# EasyEDA Pro project DartGuidence_Controller.epro

# Schematic Schematic1
Board Name: Board1; Create Date: 2024-11-17; Page Name: P1; Project Name: DartGuidence_Controller; Schematic Name: Schematic1; Update Date: 2024-12-12; Company: 嘉立创EDA; Page Size: A3; Version: V1.0
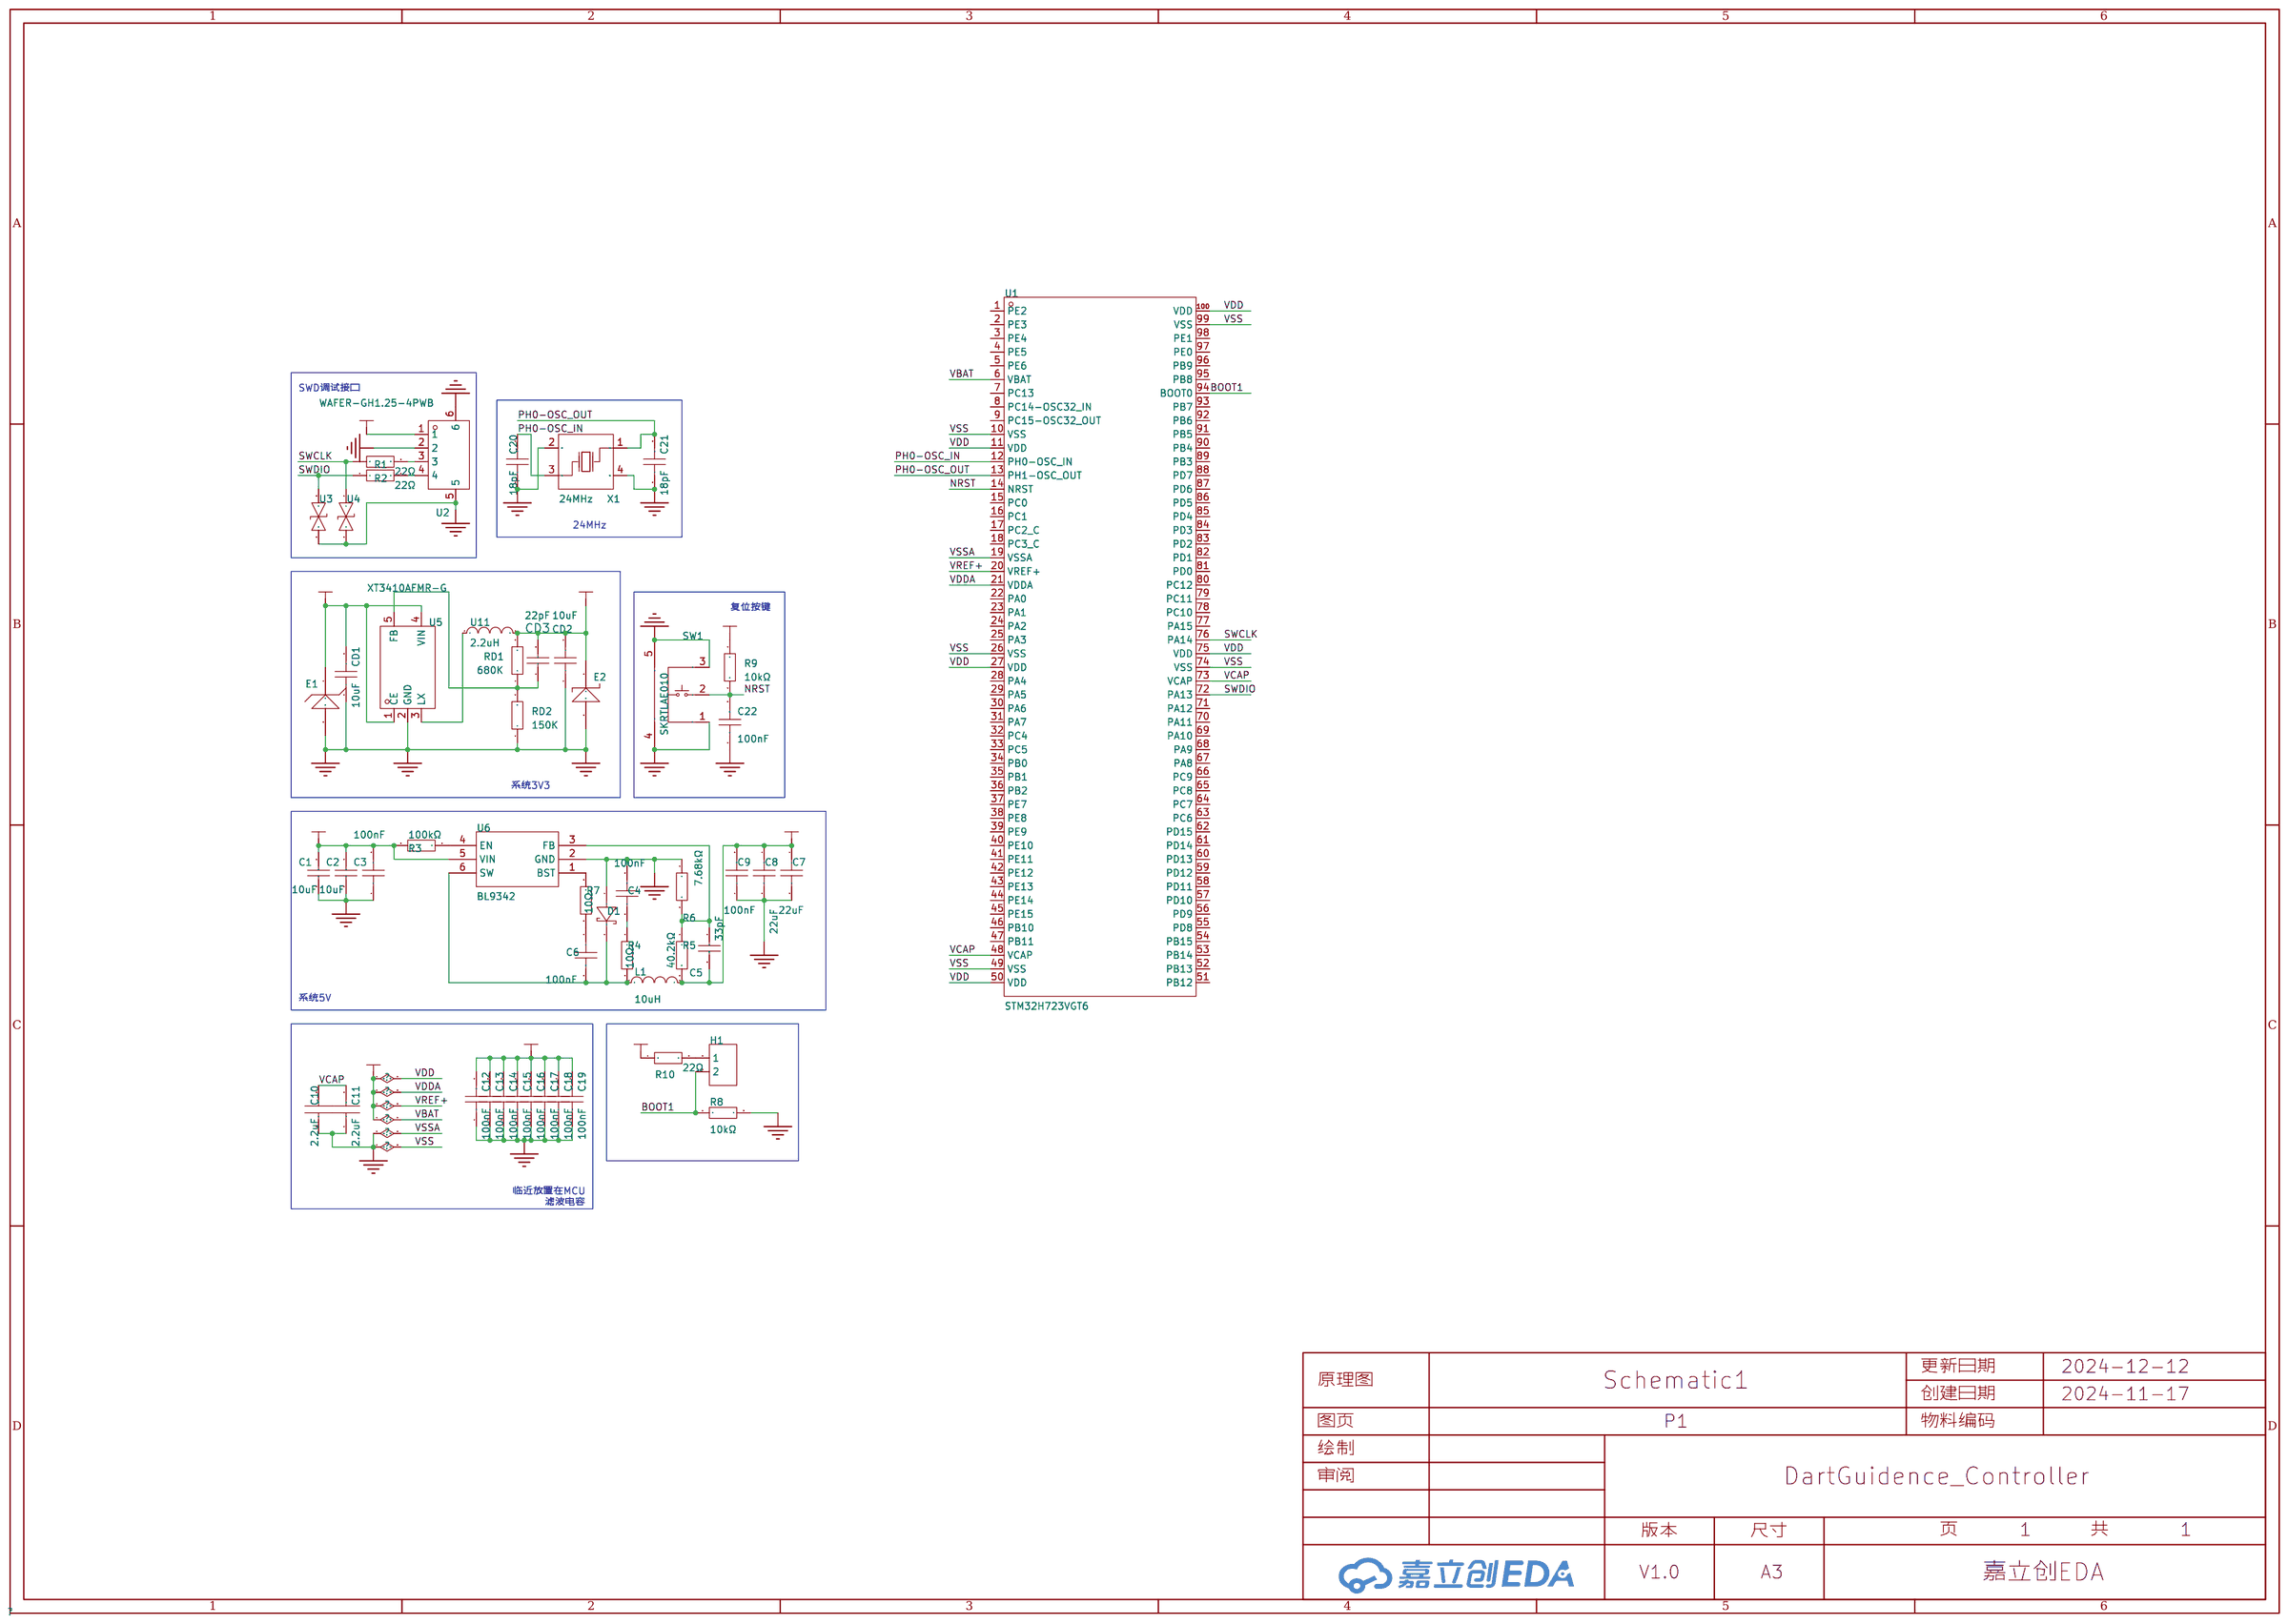
[diagram p0: schematic sheet]

## Parts
C1  10uF  [C1206]
C2  10uF  [C1206]
C3  100nF  [C0402]
C4  100nF  [C0402]
C5  33pF  [C0402]
C6  100nF  [C0402]
C7  22uF  [C0603]
C8  22uF  [C0603]
C9  100nF  [C0402]
C10  2.2uF  [C0402]
C11  2.2uF  [C0402]
C12  100nF  [C0402]
C13  100nF  [C0402]
C14  100nF  [C0402]
C15  100nF  [C0402]
C16  100nF  [C0402]
C17  100nF  [C0402]
C18  100nF  [C0402]
C19  100nF  [C0402]
C20  18pF  [C0402]
C21  18pF  [C0402]
C22  100nF  [C0402]
CD1  10uF  [C0402]
CD2  10uF  [C0402]
CD3  22pF  [C0402]
D1  SD103AWS  [SOD-323_L1.7-W1.3-LS2.5-FD]
E1  CESD5V0D3 ZA  [SOD-323_L1.8-W1.3-LS2.5-RD]
E2  CESD3V3D3 YU  [SOD-323_L1.8-W1.3-LS2.5-RD]
H1  -  [HDR-TH_2P-P2.54-V-F]
L1  10uH  [IND-SMD_L4.0-W4.0]
R1  22Ω  [R0402]
R2  22Ω  [R0402]
R3  100kΩ  [R0402]
R4  10Ω  [R0402]
R5  40.2kΩ  [R0402]
R6  7.68kΩ  [R0402]
R7  10Ω  [R0402]
R8  10kΩ  [R0402]
R9  10kΩ  [R0402]
R10  22Ω  [R0402]
RD1  680K  [R0402]
RD2  150K  [R0402]
SW1  SKRTLAE010  [KEY-SMD_SKRTLAE010]
U1  STM32H723VGT6  [LQFP-100_L14.0-W14.0-P0.50-LS16.0-BL]
U2  WAFER-GH1.25-4PWB  [CONN-SMD_4P-P1.25_XUNPU_WAFER-GH1.25-4PWB]
U3  ESD9B5.0ST5G  [SOD-923_L0.8-W0.6-LS1.0-BI]
U4  ESD9B5.0ST5G  [SOD-923_L0.8-W0.6-LS1.0-BI]
U5  XT3410AFMR-G  [SOT-23-5_L3.0-W1.7-P0.95-LS2.8-BL]
U6  BL9342  [SOT-23-6_L2.9-W1.6-P0.95-LS2.8-BL]
U11  2.2uH  [IND-SMD_L2.5-W2.0]
X1  24MHz  [CRYSTAL-SMD_4P-L2.5-W2.0-BL]

## Library data of the parts
C1 C2 = CL31A106KBHNNNE: 容值:10uF;精度:±10%;额定电压:50V;材质(温度系数):X5R;; LCSC Part Name: 10uF ±10% 50V; Supplier Part: C13585; Manufacturer: SAMSUNG(三星); Supplier Footprint: 1206; JLCPCB Part Class: 基础库; Datasheet: https://atta.szlcsc.com/upload/public/pdf/source/20160218/1457707763339.pdf; Supplier: LCSC; Tolerance: ±10%; Voltage Rated: 50V; Temperature Coefficient: X5R
C3 C4 C6 C9 = CL05B104KB54PNC: 容值:100nF;精度:±10%;额定电压:50V;材质(温度系数):X7R;; LCSC Part Name: 100nF ±10% 50V; Supplier Part: C307331; Manufacturer: SAMSUNG(三星); Supplier Footprint: 0402; JLCPCB Part Class: 基础库; Datasheet: https://atta.szlcsc.com/upload/public/pdf/source/20160218/1457707763339.pdf; Supplier: LCSC; Tolerance: ±10%; Voltage Rated: 50V; Temperature Coefficient: X7R
C5 = 0402CG330J500NT: 容值:33pF;精度:±5%;额定电压:50V;材质(温度系数):C0G;; LCSC Part Name: 33pF ±5% 50V; Supplier Part: C1562; Manufacturer: FH(风华); Supplier Footprint: 0402; JLCPCB Part Class: 基础库; Datasheet: https://atta.szlcsc.com/upload/public/pdf/source/20200305/C486355_26A10D38EF8C2A5C37091D0039909270.pdf; Supplier: LCSC; Tolerance: ±5%; Voltage Rated: 50V; Temperature Coefficient: C0G
C7 C8 = CL10A226MP8NUNE: 容值:22uF;精度:±20%;额定电压:10V;材质(温度系数):X5R;; LCSC Part Name: 22uF ±20% 10V; Supplier Part: C86295; Manufacturer: SAMSUNG(三星); Supplier Footprint: 0603; JLCPCB Part Class: 扩展库; Datasheet: https://atta.szlcsc.com/upload/public/pdf/source/20160218/1457707763339.pdf; Supplier: LCSC; Tolerance: ±20%; Voltage Rated: 10V; Temperature Coefficient: X5R
C10 C11 = CL05A225MQ5NSNC: 容值:2.2uF;精度:±20%;额定电压:6.3V;材质(温度系数):X5R;; LCSC Part Name: 2.2uF ±20% 6.3V; Supplier Part: C12530; Manufacturer: SAMSUNG(三星); Supplier Footprint: 0402; JLCPCB Part Class: 基础库; Datasheet: https://atta.szlcsc.com/upload/public/pdf/source/20160218/1457707763339.pdf; Supplier: LCSC; Tolerance: ±20%; Voltage Rated: 6.3V; Temperature Coefficient: X5R
C12-C19 C22 = CC0402KRX7R6BB104: 容值:100nF;精度:±10%;额定电压:10V;材质(温度系数):X7R;; LCSC Part Name: 100nF ±10% 10V; Supplier Part: C309458; Manufacturer: YAGEO(国巨); Supplier Footprint: 0402; JLCPCB Part Class: 扩展库; Datasheet: https://atta.szlcsc.com/upload/public/pdf/source/20181008/C309510_22F155564471FAF6A489F7D68F34234E.pdf; Supplier: LCSC; Tolerance: ±10%; Voltage Rated: 10V; Temperature Coefficient: X7R
C20 C21 = CC0402FRNPO9BN180: 容值:18pF;精度:±1%;额定电压:50V;材质(温度系数):NP0;; LCSC Part Name: 18pF ±1% 50V; Supplier Part: C541431; Manufacturer: YAGEO(国巨); Supplier Footprint: 0402; JLCPCB Part Class: 扩展库; Datasheet: https://atta.szlcsc.com/upload/public/pdf/source/20200615/C541431_FAFCAA54FB89671184DDCAE44D787100.pdf; Supplier: LCSC; Tolerance: ±1%; Voltage Rated: 50V; Temperature Coefficient: NP0
CD1 CD2 = CL05A106MP5NUNC: 容值:10uF;精度:±20%;额定电压:10V;材质(温度系数):X5R;; LCSC Part Name: 10uF ±20% 10V; Supplier Part: C315248; Manufacturer: SAMSUNG(三星); Supplier Footprint: 0402; JLCPCB Part Class: Extended Part; Datasheet: https://atta.szlcsc.com/upload/public/pdf/source/20200102/C478861_C4302703595930F3C0E62DAD3349F1AA.pdf; Supplier: LCSC; Tolerance: ±20%; Voltage Rated: 10V; Temperature Coefficient: X5R
CD3 = 0402CG220J500NT: 容值:22pF;精度:±5%;额定电压:50V;材质(温度系数):C0G;; LCSC Part Name: 22pF ±5% 50V; Supplier Part: C1555; Manufacturer: FH(风华); Supplier Footprint: 0402; JLCPCB Part Class: 基础库; Datasheet: https://atta.szlcsc.com/upload/public/pdf/source/20200305/C486355_26A10D38EF8C2A5C37091D0039909270.pdf; Supplier: LCSC; Tolerance: ±5%; Voltage Rated: 50V; Temperature Coefficient: C0G
D1 = SD103AWS_C7420360: 二极管配置:独立式;正向压降(Vf):370mV@20mA;直流反向耐压(Vr):40V;平均整流电流(Io):350mA;; LCSC Part Name: 电压:40V 电流:350mA; Supplier Part: C7420360; Manufacturer: 宏迦橙; Supplier Footprint: SOD-323; JLCPCB Part Class: 扩展库; Datasheet: https://atta.szlcsc.com/upload/public/pdf/source/20230828/EB98D42952FEC013AACB2F62A2475546.pdf; Supplier: LCSC; Diode Configuration: 独立式; Forward Voltage (Vf@If): 370mV@20mA; Reverse Voltage (Vr): 40V; Average Rectified Current (Io): 350mA; Reverse Leakage Current (Ir): 5uA@40V; Peak forward surge current: 1.5A
E1 = CESD5V0D3 ZA: 极性:单向;反向截止电压(Vrwm):5V;击穿电压(VBR):6.2V;钳位电压(Vc)@Ipp:15.5V;; LCSC Part Name: 单向ESD; Supplier Part: C22643; Manufacturer: CJ(江苏长电/长晶); Supplier Footprint: SOD-323; JLCPCB Part Class: 扩展库; Datasheet: https://atta.szlcsc.com/upload/public/pdf/source/20140301/1457707004115.pdf; Supplier: LCSC; Polarity: 单向; Reverse Stand-Off Voltage (Vrwm): 5V; Breakdown Voltage (VBR): 6.2V; Peak Pulse Current(Ipp)@8/20us: 15A; Clamping Voltage@Ipp: 15.5V
E2 = CESD3V3D3 YU: 极性:单向;反向截止电压(Vrwm):3.3V;击穿电压(VBR):5V;钳位电压(Vc)@Ipp:13V;; LCSC Part Name: 单向ESD; Supplier Part: C38388; Manufacturer: CJ(江苏长电/长晶); Supplier Footprint: SOD-323; JLCPCB Part Class: 扩展库; Datasheet: https://atta.szlcsc.com/upload/public/pdf/source/20150915/1457707371129.pdf; Supplier: LCSC; Polarity: 单向; Reverse Stand-Off Voltage (Vrwm): 3.3V; Breakdown Voltage (VBR): 5V; Peak Pulse Current(Ipp)@8/20us: 16A; Clamping Voltage@Ipp: 13V
H1 = HDR-F_2.54_1x2P: Supplier Part: C49661; Supplier Footprint: 插件
L1 = FHD4020S-100MT: 电感值:10uH;精度:±20%;额定电流:2.35A;饱和电流(Isat):3.5A;; LCSC Part Name: 10uH ±20% 3.5A; Supplier Part: C602032; Manufacturer: cjiang(长江微电); Supplier Footprint: SMD,4x4mm; JLCPCB Part Class: 扩展库; Datasheet: https://atta.szlcsc.com/upload/public/pdf/source/20200609/C601990_BCEA243EC4DA0A9A288AA78A6DFB48A5.pdf; Supplier: LCSC; Tolerance: ±20%; Rated Current: 2.35A; Saturation Current (Isat): 3.5A; DC Resistance (DCR): 190mΩ
R1 R2 R10 = 0402WGF220JTCE: 电阻类型:厚膜电阻;阻值:22Ω;精度:±1%;功率:62.5mW;最大工作电压:50V;温度系数:±100ppm/℃;; LCSC Part Name: 22Ω ±1% 62.5mW 厚膜电阻; Supplier Part: C25092; Manufacturer: UNI-ROYAL(厚声); Supplier Footprint: 0402; JLCPCB Part Class: 基础库; Datasheet: https://atta.szlcsc.com/upload/public/pdf/source/20200306/C422600_1E6D84923E4A46A82E41ADD87F860B5C.pdf; Supplier: LCSC; Type: 厚膜电阻; Tolerance: ±1%; Power(Watts): 62.5mW; Overload Voltage (Max): 50V; Temperature Coefficient: ±100ppm/℃; Operating Temperature Range: -55℃~+155℃
R3 = 0402WGF1003TCE: 电阻类型:厚膜电阻;阻值:100kΩ;精度:±1%;功率:62.5mW;最大工作电压:50V;温度系数:±100ppm/℃;; LCSC Part Name: 100kΩ ±1% 62.5mW 厚膜电阻; Supplier Part: C25741; Manufacturer: UNI-ROYAL(厚声); Supplier Footprint: 0402; JLCPCB Part Class: 基础库; Datasheet: https://atta.szlcsc.com/upload/public/pdf/source/20200306/C422600_1E6D84923E4A46A82E41ADD87F860B5C.pdf; Supplier: LCSC; Type: 厚膜电阻; Tolerance: ±1%; Power(Watts): 62.5mW; Overload Voltage (Max): 50V; Temperature Coefficient: ±100ppm/℃; Operating Temperature Range: -55℃~+155℃
R4 R7 = 0402WGF100JTCE: 电阻类型:厚膜电阻;阻值:10Ω;精度:±1%;功率:62.5mW;最大工作电压:50V;温度系数:±200ppm/℃;; LCSC Part Name: 10Ω ±1% 62.5mW 厚膜电阻; Supplier Part: C25077; Manufacturer: UNI-ROYAL(厚声); Supplier Footprint: 0402; JLCPCB Part Class: 基础库; Datasheet: https://atta.szlcsc.com/upload/public/pdf/source/20200306/C422600_1E6D84923E4A46A82E41ADD87F860B5C.pdf; Supplier: LCSC; Type: 厚膜电阻; Tolerance: ±1%; Power(Watts): 62.5mW; Overload Voltage (Max): 50V; Temperature Coefficient: ±200ppm/℃; Operating Temperature Range: -55℃~+155℃
R5 = 0402WGF4022TCE: 电阻类型:厚膜电阻;阻值:40.2kΩ;精度:±1%;功率:62.5mW;最大工作电压:50V;温度系数:±100ppm/℃;; LCSC Part Name: 40.2kΩ ±1% 62.5mW 厚膜电阻; Supplier Part: C25893; Manufacturer: UNI-ROYAL(厚声); Supplier Footprint: 0402; JLCPCB Part Class: 扩展库; Datasheet: https://atta.szlcsc.com/upload/public/pdf/source/20200306/C422600_1E6D84923E4A46A82E41ADD87F860B5C.pdf; Supplier: LCSC; Type: 厚膜电阻; Tolerance: ±1%; Power(Watts): 62.5mW; Overload Voltage (Max): 50V; Temperature Coefficient: ±100ppm/℃; Operating Temperature Range: -55℃~+155℃
R6 = 0402WGF7681TCE: 电阻类型:厚膜电阻;阻值:7.68kΩ;精度:±1%;功率:62.5mW;最大工作电压:50V;温度系数:±100ppm/℃;; LCSC Part Name: 7.68kΩ ±1% 62.5mW 厚膜电阻; Supplier Part: C25919; Manufacturer: UNI-ROYAL(厚声); Supplier Footprint: 0402; JLCPCB Part Class: 扩展库; Datasheet: https://atta.szlcsc.com/upload/public/pdf/source/20200306/C422600_1E6D84923E4A46A82E41ADD87F860B5C.pdf; Supplier: LCSC; Type: 厚膜电阻; Tolerance: ±1%; Power(Watts): 62.5mW; Overload Voltage (Max): 50V; Temperature Coefficient: ±100ppm/℃; Operating Temperature Range: -55℃~+155℃
R8 R9 = 0402WGF1002TCE: 电阻类型:厚膜电阻;阻值:10kΩ;精度:±1%;功率:62.5mW;最大工作电压:50V;温度系数:±100ppm/℃;; LCSC Part Name: 10kΩ ±1% 62.5mW 厚膜电阻; Supplier Part: C25744; Manufacturer: UNI-ROYAL(厚声); Supplier Footprint: 0402; JLCPCB Part Class: 基础库; Datasheet: https://atta.szlcsc.com/upload/public/pdf/source/20200306/C422600_1E6D84923E4A46A82E41ADD87F860B5C.pdf; Supplier: LCSC; Type: 厚膜电阻; Tolerance: ±1%; Power(Watts): 62.5mW; Overload Voltage (Max): 50V; Temperature Coefficient: ±100ppm/℃; Operating Temperature Range: -55℃~+155℃
RD1 RD2 = Res_0603: Supplier Footprint: 0603; Check: false
SW1 = SKRTLAE010: 电路结构:单刀单掷;按钮形状:圆形按钮;安装方式:卧贴;开关长度:4.5mm;开关宽度:3.4mm;开关高度:3.3mm;触点电流:50mA;额定电压(DC):12V;带灯:-;机械寿命:-;; LCSC Part Name: 4.5*3.4*3.3mm 卧贴 轻触开关; Supplier Part: C110293; Manufacturer: ALPSALPINE(阿尔卑斯阿尔派); Supplier Footprint: SMD; JLCPCB Part Class: 扩展库; Datasheet: https://atta.szlcsc.com/upload/public/pdf/source/20170428/1493376812809.pdf; Supplier: LCSC; Circuit: 单刀单掷; Actuator Style: 圆形按钮; Mounting Style: 卧贴; Switch Length: 4.5mm; Switch Width: 3.4mm; Switch Height: 3.3mm; Contact Current: 50mA; Voltage Rating (DC): 12V
U1 = STM32H723VGT6: CPU内核:-;程序存储容量:1MB;RAM总容量:564KB;GPIO端口数量:80;工作电压范围:1.71V~3.6V;CPU最大主频:550MHz;程序存储器类型:FLASH;应用领域:-;; LCSC Part Name: 高性能和带 DP-FPU 的 DSP、1 MByte 闪存的 Arm Cortex-M7 微控制器、564 Kbyte RAM、550 MHz CPU、L1 缓存、外部内存接口、外围设备子集; Supplier Part: C730142; Manufacturer: ST(意法半导体); Supplier Footprint: LQFP-100(14x14); JLCPCB Part Class: 扩展库; Datasheet: https://atta.szlcsc.com/upload/public/pdf/source/20200902/C730141_32325B298F902737689CA9A88D6BD2F2.pdf; Supplier: LCSC; Program Storage Size: 1MB; RAM Size: 564KB; GPIO Ports Number: 80; Operating Voltage Range: 1.71V~3.6V; CPU Maximum Speed: 550MHz; Program Memory Type: FLASH; Operating Temperature Range: -40℃~+85℃; ADC (Bit): 16bit; DAC (Bit): 12bit; Universal Serial Bus: 有; Peripheral/Function: DMA；LCD/LED驱动; Secure Digital Input and Output: 有; Internal Oscillator: 有
U2 = WAFER-GH1.25-4PWB: 插针结构:1x4P;间距:1.25mm;安装方式:卧贴;参考系列:GH;总PIN数:4P;排数:1;每排PIN数:4;额定电流:1A;工作温度范围:-25℃~+85℃;; LCSC Part Name: 1x4P 间距:1.25mm 卧贴 系列:GH; Supplier Part: C3029379; Manufacturer: XUNPU(讯普); Supplier Footprint: SMD,P=1.25mm,卧贴; JLCPCB Part Class: 扩展库; Datasheet: https://atta.szlcsc.com/upload/public/pdf/source/20220527/CB8773BFB0913C3B8ABD62CB38BA101A.pdf; Supplier: LCSC; Pins Structure: 1x4P; Pitch: 1.25mm; Mounting Style: 卧贴; Reference Series: GH; Number of Pins: 4P; Number of Rows: 1; Number of PINs Per Row: 4; Current Rating (Max): 1A; Operating Temperature Range: -25℃~+85℃
U3 U4 = ESD9B5.0ST5G_C3021104: 极性:双向;反向截止电压(Vrwm):5V;最大钳位电压:10V;峰值脉冲电流(Ipp):8A;峰值脉冲功率(Ppp):80W;击穿电压:8.4V;; Supplier Part: C3021104; Manufacturer: TECH PUBLIC(台舟); Supplier Footprint: SOD-923; JLCPCB Part Class: 扩展库; Datasheet: https://atta.szlcsc.com/upload/public/pdf/source/20220524/6CC5EA9A5BA15BBB56040E503B840966.pdf; Supplier: LCSC; polarity: 双向; Reverse Stand-Off Voltage (Vrwm): 5V; Maximum Clamping Voltage: 10V; Peak Pulse Current (Ipp): 8A; Peak Pulse Power Dissipation (Ppp): 80W; Breakdown Voltage: 8.4V; Reverse Leakage Current (Ir): 80nA; Number of Lines: 单路; Operating Temperature: -55℃~+125℃; level of protection: IEC 61000-4-2; Type: ESD
U5 = XT3410AFMR-G: 功能类型:降压型;输出类型:固定;输入电压:2.5V~6V;输出电压:600mV~1.8V;输出电流:1.5A;; LCSC Part Name: 高效PWM/PFM控制DC-DC降压转换器; Supplier Part: C190829; Manufacturer: natlinear(南麟); Supplier Footprint: SOT-23-5L; JLCPCB Part Class: 扩展库; Datasheet: https://atta.szlcsc.com/upload/public/pdf/source/20180417/C190829_F6912E3BE098993FBE8C3B1025739217.pdf; Supplier: LCSC; Function: 降压型; Output Type: 固定; Input Voltage: 2.5V~6V; Output Voltage: 600mV~1.8V; Output Current: 1.5A; Switching Frequency: 1.5MHz; Operating Temperature: -40℃~+85℃; Synchronous Rectification: 是; Number of Outputs: 1; Topology: 降压式; Quiescent Current (Iq): 40uA; Switch tube (built-in/external): 内置
U6 = BL9342: 功能类型:降压型;输入电压:4.2V~40V;输出电流:600mA;; LCSC Part Name: 40V,600mA降压型稳压电路; Supplier Part: C93176; Manufacturer: BL(上海贝岭); Supplier Footprint: SOT-23-6; JLCPCB Part Class: 扩展库; Datasheet: https://atta.szlcsc.com/upload/public/pdf/source/20220914/8FD74402BCE4B7AF0FD3964135D49DC4.pdf; Supplier: LCSC; Function: 降压型; Input Voltage: 4.2V~40V; Output Current: 600mA; Switching Frequency: 1.8MHz; Operating Temperature: -40℃~+125℃@(TJ); Number of Outputs: 1; Topology: 降压式; Switch tube (built-in/external): 内置
U11 = SMMS252010-3R3M: 电感值:3.3uH;精度:±20%;; LCSC Part Name: 3.3uH ±20%; Supplier Part: C5161636; Manufacturer: SXN(顺翔诺); Supplier Footprint: SMD,2x2.5mm; JLCPCB Part Class: Extended Part; Datasheet: https://atta.szlcsc.com/upload/public/pdf/source/20220915/1B56D3CEE5BC15077D1615000298C9B6.pdf; Supplier: LCSC; Tolerance: ±20%
X1 = X252024MRB4SI: 晶振类型:贴片晶振;频率:24MHz;常温频差:±10ppm;外接负载电容:18pF;频率稳定度(全温):±20ppm;; LCSC Part Name: 24MHz ±10ppm 18pF; Supplier Part: C371128; Manufacturer: YXC(扬兴晶振); Supplier Footprint: SMD2520-4P; JLCPCB Part Class: 扩展库; Datasheet: https://atta.szlcsc.com/upload/public/pdf/source/20240329/8B53C0AFBC5BB264DFB5D72B3757797A.pdf; Supplier: LCSC; Crystal Type: 贴片晶振; Normal temperature Frequency Tolerance: ±10ppm; External load capacitor: 18pF; Frequency Stability(Full temperature range): ±20ppm; Operating Temperature: -40℃~+85℃

## Nets
GND: C1.1 C2.1 C3.1 C4.1 C7.2 C8.2 C9.1 C10.1 C11.1 C12.1 C13.1 C14.1 C15.1 C16.1 C17.1 C18.1 C19.1 C20.1 C21.1 C22.1 CD1.1 CD2.1 D1.1(A) E1.2 E2.2 R6.1 R8.2 RD2.1 SW1.1 SW1.3 SW1.4 SW1.5 U1.10(VSS) U1.19(VSSA) U1.26(VSS) U1.49(VSS) U1.74(VSS) U1.99(VSS) U2.2 U2.5 U2.6 U3.1 U4.2 U5.2(GND) U6.2(GND) X1.2(GND) X1.4(GND)
VCC_3V3: C12.2 C13.2 C14.2 C15.2 C16.2 C17.2 C18.2 C19.2 CD2.2 CD3.2 E2.1 R9.1 R10.1 RD1.2 U1.6(VBAT) U1.11(VDD) U1.20(VREF+) U1.21(VDDA) U1.27(VDD) U1.50(VDD) U1.75(VDD) U1.100(VDD) U2.1 U11.2
VCC_5VS: C5.2 C7.1 C8.1 C9.2 CD1.2 E1.1 L1.2 R5.2 U5.1(CE) U5.4(VIN)
VCC_IN: C1.2 C2.2 C3.2 R3.2 U6.5(VIN)
BOOT1: H1.2 R8.1 U1.94(BOOT0)
NRST: C22.2 R9.2 SW1.2 U1.14(NRST)
PH0-OSC_IN: C20.2 U1.12(PH0-OSC_IN) X1.3(OSC2)
PH0-OSC_OUT: C21.2 U1.13(PH1-OSC_OUT) X1.1(OSC1)
SWCLK: R1.1 U1.76(PA14) U4.1
SWDIO: R2.1 U1.72(PA13) U3.2
VCAP: C10.2 C11.2 U1.48(VCAP) U1.73(VCAP)
$1N3775: R1.2 U2.3
$1N3814: R2.2 U2.4
$1N4985: U5.3(LX) U11.1
$1N4987: CD3.1 RD1.1 RD2.2 U5.5(FB)
$1N6159: R3.1 U6.4(EN)
$1N6463: C4.2 R4.1
$1N6883: R7.1 U6.1(BST)
$1N6991: C6.1 R7.2
$1N7111: C5.1 R5.1 R6.2 U6.3(FB)
$1N7412: C6.2 D1.2(K) L1.1 R4.2 U6.6(SW)
$1N16429: H1.1 R10.2

Not connected (* = marked no-connect by the designer): U1 1(PE2) 2(PE3) 3(PE4) 4(PE5) 5(PE6) 7(PC13) 8(PC14-OSC32_IN) 9(PC15-OSC32_OUT) 15(PC0) 16(PC1) 17(PC2_C) 18(PC3_C) 22(PA0) 23(PA1) 24(PA2) 25(PA3) 28(PA4) 29(PA5) 30(PA6) 31(PA7) 32(PC4) 33(PC5) 34(PB0) 35(PB1) 36(PB2) 37(PE7) 38(PE8) 39(PE9) 40(PE10) 41(PE11) 42(PE12) 43(PE13) 44(PE14) 45(PE15) 46(PB10) 47(PB11) 51(PB12) 52(PB13) 53(PB14) 54(PB15) 55(PD8) 56(PD9) 57(PD10) 58(PD11) 59(PD12) 60(PD13) 61(PD14) 62(PD15) 63(PC6) 64(PC7) 65(PC8) 66(PC9) 67(PA8) 68(PA9) 69(PA10) 70(PA11) 71(PA12) 77(PA15) 78(PC10) 79(PC11) 80(PC12) 81(PD0) 82(PD1) 83(PD2) 84(PD3) 85(PD4) 86(PD5) 87(PD6) 88(PD7) 89(PB3) 90(PB4) 91(PB5) 92(PB6) 93(PB7) 95(PB8) 96(PB9) 97(PE0) 98(PE1)

## Notes on the sheet
- SWD调试接口
- 24MHz
- 复位按键
- 系统3V3
- 系统5V
- 临近放置在MCU
  滤波电容

# Schematic SC130GS_MIPI
Board Name: Board2; Create Date: 2025-07-01; Page Name: P1; Project Name: DartGuidence_Controller; Schematic Name: SC130GS_MIPI; Update Date: 2025-07-04; Company: 嘉立创EDA; Page Size: A4; Version: V1.0
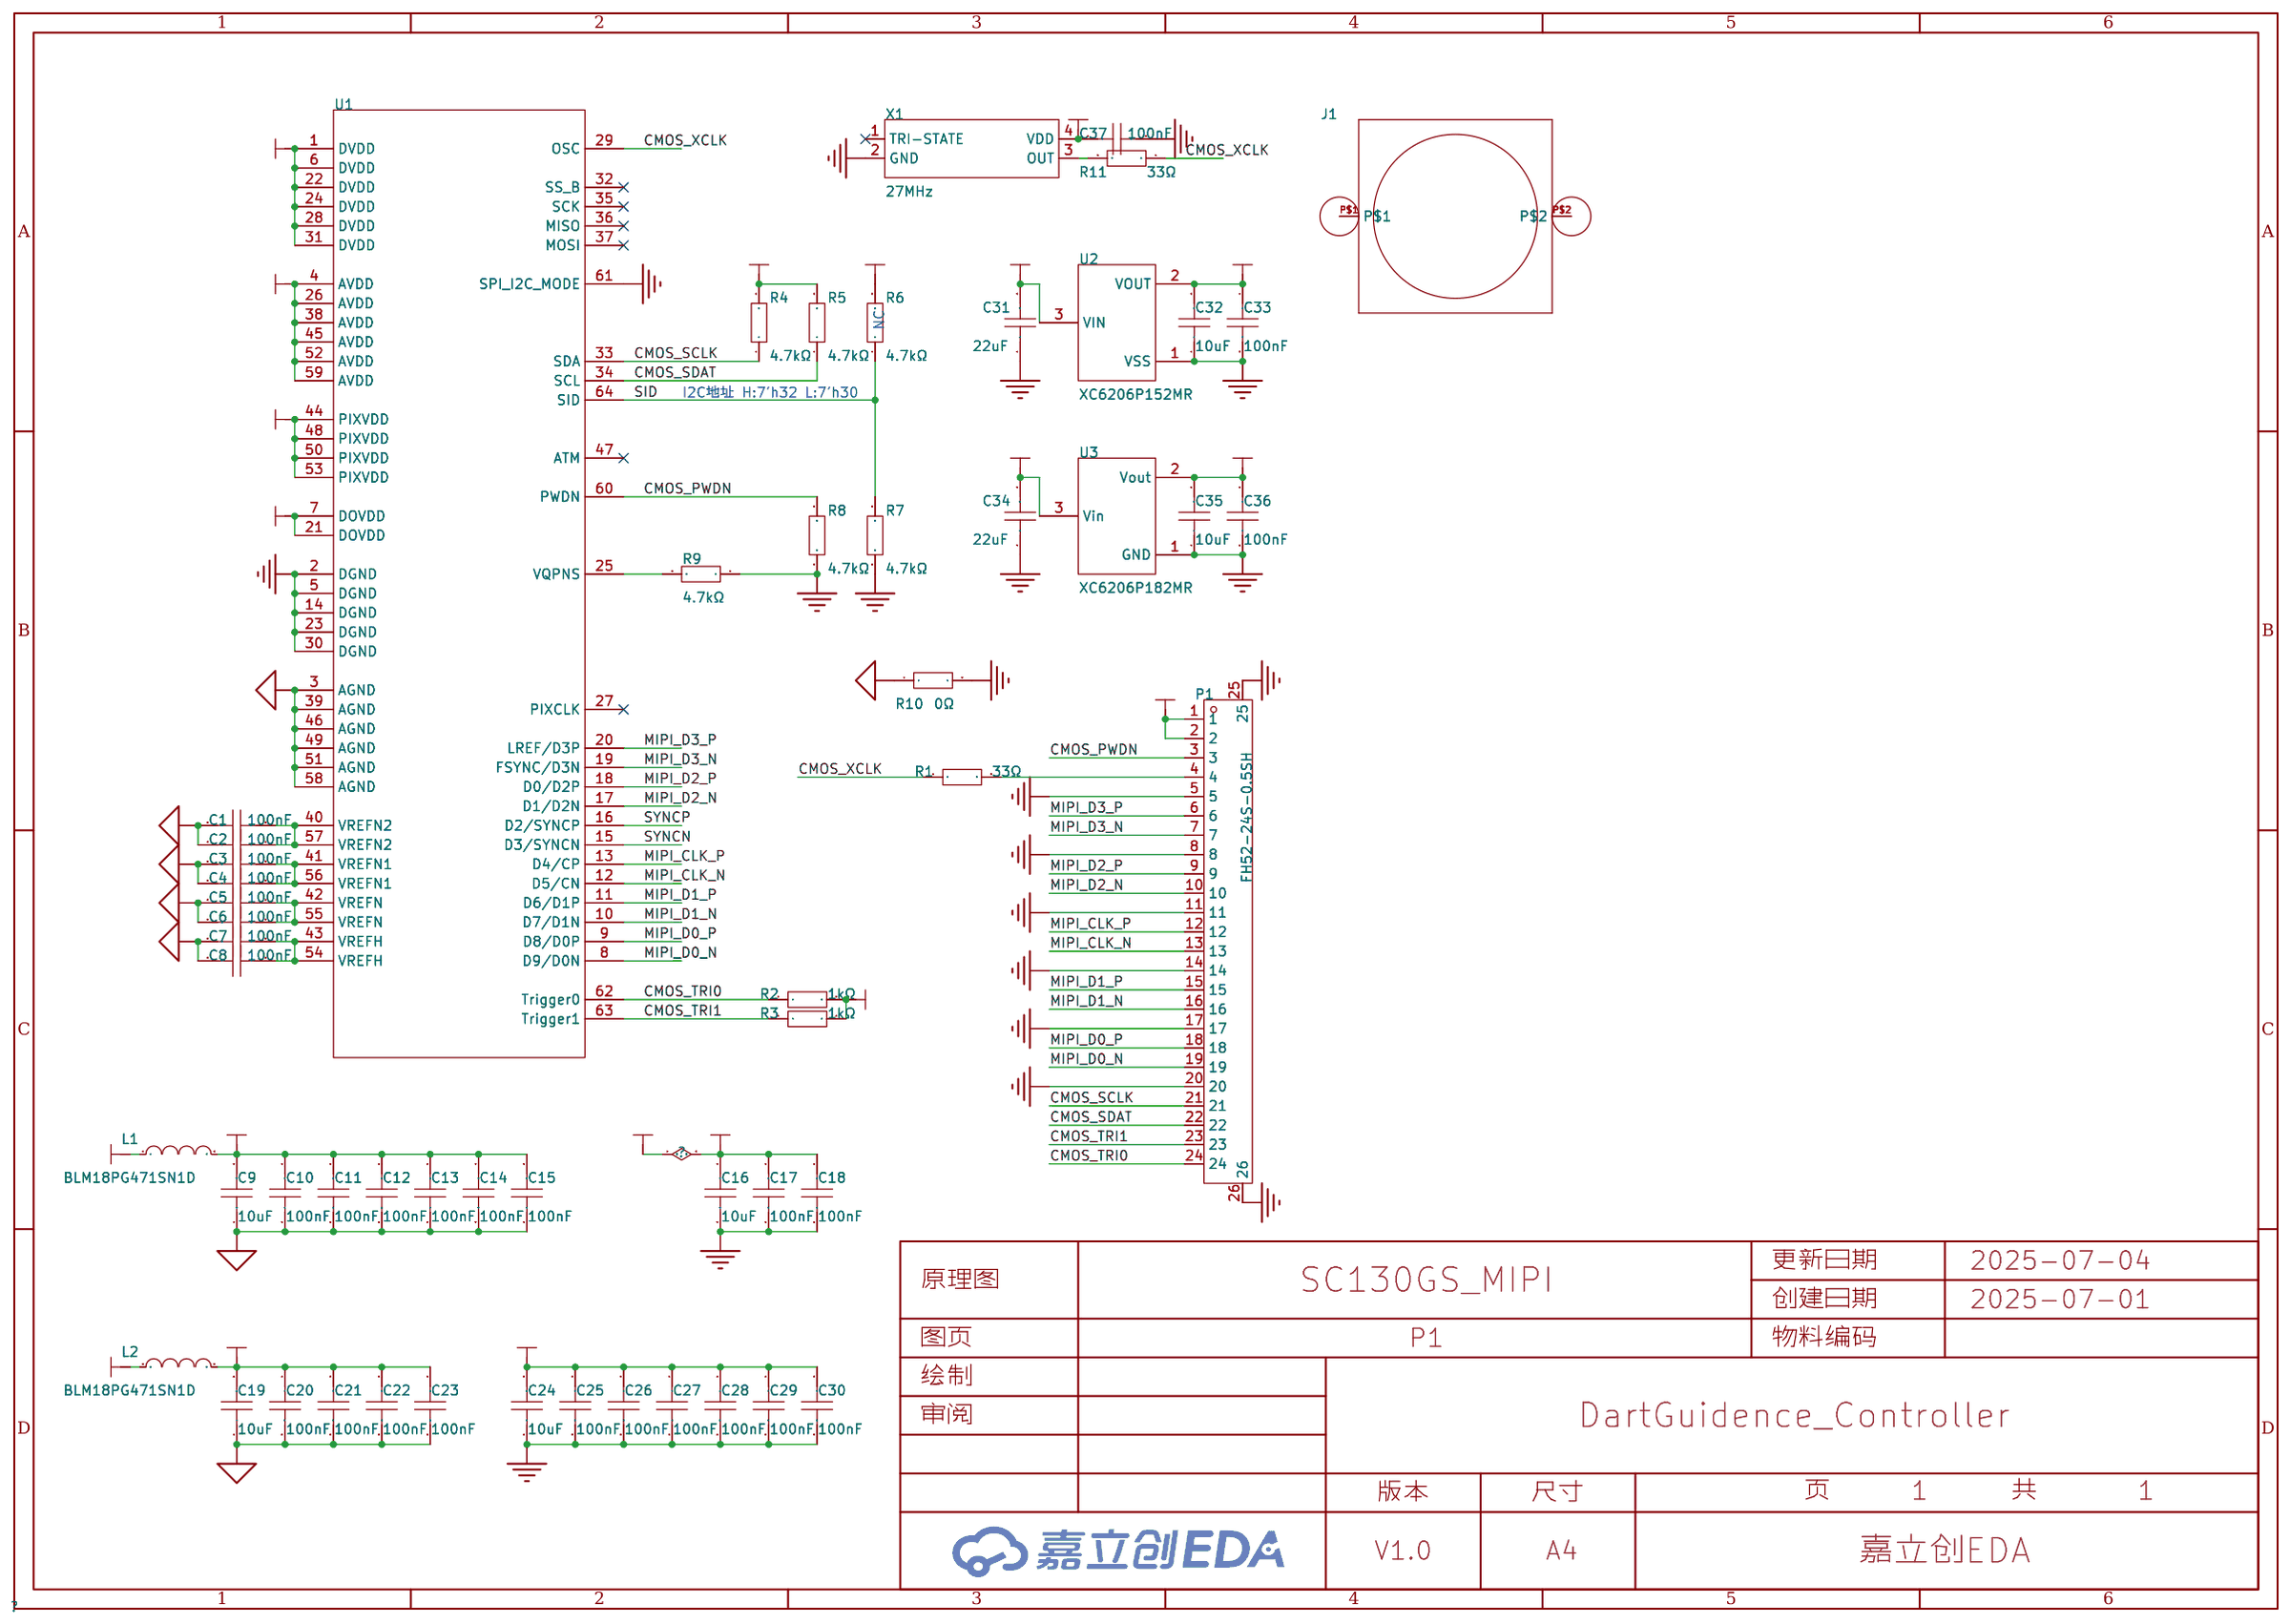
[diagram p1: schematic sheet]

## Parts
C1  100nF  [R0402]
C2  100nF  [R0402]
C3  100nF  [R0402]
C4  100nF  [R0402]
C5  100nF  [R0402]
C6  100nF  [R0402]
C7  100nF  [R0402]
C8  100nF  [R0402]
C9  10uF  [C0603]
C10  100nF  [R0402]
C11  100nF  [R0402]
C12  100nF  [R0402]
C13  100nF  [R0402]
C14  100nF  [R0402]
C15  100nF  [R0402]
C16  10uF  [C0603]
C17  100nF  [R0402]
C18  100nF  [R0402]
C19  10uF  [C0603]
C20  100nF  [R0402]
C21  100nF  [R0402]
C22  100nF  [R0402]
C23  100nF  [R0402]
C24  10uF  [C0603]
C25  100nF  [R0402]
C26  100nF  [R0402]
C27  100nF  [R0402]
C28  100nF  [R0402]
C29  100nF  [R0402]
C30  100nF  [R0402]
C31  22uF  [C0805]
C32  10uF  [C0603]
C33  100nF  [R0402]
C34  22uF  [C0805]
C35  10uF  [C0603]
C36  100nF  [R0402]
C37  100nF  [R0402]
J1  -  [LENSMOUNT-20MM]
L1  BLM18PG471SN1D  [L0603]
L2  BLM18PG471SN1D  [L0603]
P1  FH52-24S-0.5SH  [CONN-SMD_FH52-24S-0.5SH05]
R1  33Ω  [R0402]
R2  1kΩ  [R0402]
R3  1kΩ  [R0402]
R4  4.7kΩ  [R0402]
R5  4.7kΩ  [R0402]
R6  4.7kΩ  [R0402]
R7  4.7kΩ  [R0402]
R8  4.7kΩ  [R0402]
R9  4.7kΩ  [R0402]
R10  0Ω  [R0603]
R11  33Ω  [R0402]
U1  -  [CLCC-64_L13.0-W13.0-P0.70-T]
U2  XC6206P152MR  [SOT-23-3_L2.9-W1.3-P1.90-LS2.4-BR]
U3  XC6206P182MR  [SOT-23-3_L2.9-W1.6-P1.90-LS2.8-BR]
X1  27MHz  [OSC-SMD_4P-L5.0-W3.2-BL-1]

## Library data of the parts
C1-C8 C10-C15 C17 C18 C20-C23 C25-C30 C33 C36 C37 = CL05B104KO5NNNC: 容值:100nF;精度:±10%;额定电压:16V;材质(温度系数):X7R;; LCSC Part Name: 100nF ±10% 16V; Supplier Part: C1525; Manufacturer: SAMSUNG(三星); Supplier Footprint: 0402; JLCPCB Part Class: 基础库; Datasheet: https://atta.szlcsc.com/upload/public/pdf/source/20160218/1457707763339.pdf; Supplier: LCSC; Tolerance: ±10%; Voltage Rated: 16V; Temperature Coefficient: X7R
C9 C19 C24 C32 C35 = CL10A106KP8NNNC: 容值:10uF;精度:±10%;额定电压:10V;材质(温度系数):X5R;; LCSC Part Name: 10uF ±10% 10V; Supplier Part: C19702; Manufacturer: SAMSUNG(三星); Supplier Footprint: 0603; JLCPCB Part Class: 基础库; Datasheet: https://atta.szlcsc.com/upload/public/pdf/source/20160218/1457707763339.pdf; Supplier: LCSC; Tolerance: ±10%; Voltage Rated: 10V; Temperature Coefficient: X5R
C16 = CL10A106KP8NNNC: 容值:10uF;精度:±10%;额定电压:10V;材质(温度系数):X5R;; LCSC Part Name: 10uF ±10% 10V; Supplier Part: C19702; Manufacturer: SAMSUNG(三星); Supplier Footprint: 0603; JLCPCB Part Class: Basic Part; Datasheet: https://atta.szlcsc.com/upload/public/pdf/source/20160218/1457707763339.pdf; Supplier: LCSC; Tolerance: ±10%; Voltage Rated: 10V; Temperature Coefficient: X5R
C31 C34 = CL21A226MAQNNNE: 容值:22uF;精度:±20%;额定电压:25V;材质(温度系数):X5R;; LCSC Part Name: 22uF ±20% 25V; Supplier Part: C45783; Manufacturer: SAMSUNG(三星); Supplier Footprint: 0805; JLCPCB Part Class: 基础库; Datasheet: https://atta.szlcsc.com/upload/public/pdf/source/20160218/1457707763339.pdf; Supplier: LCSC; Tolerance: ±20%; Voltage Rated: 25V; Temperature Coefficient: X5R
J1 = LENSMOUNT-20MM: 20mm间距镜头底座
L1 L2 = BLM18PG471SN1D: 标称阻抗@测试频率:470Ω@100MHz;误差:±25%;直流电阻(RDC):200mΩ;; LCSC Part Name: 单路 0603磁珠 阻抗470Ω@100MHz; Supplier Part: C97853; Manufacturer: muRata(村田); Supplier Footprint: 0603; JLCPCB Part Class: 扩展库; Datasheet: https://atta.szlcsc.com/upload/public/pdf/source/20180329/C160981_FD3C2D2622A377E203B89F4AA32B0741.pdf; Supplier: LCSC; Impedance @ Frequency: 470Ω@100MHz; Tolerance: ±25%; DC Resistance: 200mΩ; Current Rating: 1A; Circuits: 1
P1 = FH52-24S-0.5SH: 锁定特性:翻盖式;触点类型:下接;触点数量:24P;间距:0.5mm;安装类型:卧贴;工作温度范围:-40℃~+105℃;; LCSC Part Name: 间距:0.5mm P数:24P 翻盖式 下接; Supplier Part: C5378714; Manufacturer: HRS(广濑); Supplier Footprint: SMD,P=0.5mm,卧贴; JLCPCB Part Class: Extended Part; Supplier: LCSC; Locking Feature: 翻盖式; Contact Type: 下接; Number of Contacts: 24P; Pitch: 0.5mm; Mounting Type: 卧贴; FFC, FCB Thickness: 0.3mm; Height Above Board: 2mm; Contact Material: 磷青铜; Contact Plating: 金; Operating Temperature Range: -40℃~+105℃
R1 R11 = 0402WGF330JTCE: 电阻类型:厚膜电阻;阻值:33Ω;精度:±1%;功率:62.5mW;最大工作电压:50V;温度系数:±100ppm/℃;; LCSC Part Name: 33Ω ±1% 62.5mW 厚膜电阻; Supplier Part: C25105; Manufacturer: UNI-ROYAL(厚声); Supplier Footprint: 0402; JLCPCB Part Class: 基础库; Datasheet: https://atta.szlcsc.com/upload/public/pdf/source/20200306/C422600_1E6D84923E4A46A82E41ADD87F860B5C.pdf; Supplier: LCSC; Type: 厚膜电阻; Tolerance: ±1%; Power(Watts): 62.5mW; Overload Voltage (Max): 50V; Temperature Coefficient: ±100ppm/℃; Operating Temperature Range: -55℃~+155℃
R2 R3 = 0402WGF1001TCE: 电阻类型:厚膜电阻;阻值:1kΩ;精度:±1%;功率:62.5mW;最大工作电压:50V;温度系数:±100ppm/℃;; LCSC Part Name: 1kΩ ±1% 62.5mW 厚膜电阻; Supplier Part: C11702; Manufacturer: UNI-ROYAL(厚声); Supplier Footprint: 0402; JLCPCB Part Class: 基础库; Datasheet: https://atta.szlcsc.com/upload/public/pdf/source/20200306/C422600_1E6D84923E4A46A82E41ADD87F860B5C.pdf; Supplier: LCSC; Type: 厚膜电阻; Tolerance: ±1%; Power(Watts): 62.5mW; Overload Voltage (Max): 50V; Temperature Coefficient: ±100ppm/℃; Operating Temperature Range: -55℃~+155℃
R4-R9 = 0402WGF4701TCE: 电阻类型:厚膜电阻;阻值:4.7kΩ;精度:±1%;功率:62.5mW;最大工作电压:50V;温度系数:±100ppm/℃;; LCSC Part Name: 4.7kΩ ±1% 62.5mW 厚膜电阻; Supplier Part: C25900; Manufacturer: UNI-ROYAL(厚声); Supplier Footprint: 0402; JLCPCB Part Class: 基础库; Datasheet: https://atta.szlcsc.com/upload/public/pdf/source/20200306/C422600_1E6D84923E4A46A82E41ADD87F860B5C.pdf; Supplier: LCSC; Type: 厚膜电阻; Tolerance: ±1%; Power(Watts): 62.5mW; Overload Voltage (Max): 50V; Temperature Coefficient: ±100ppm/℃; Operating Temperature Range: -55℃~+155℃
R10 = 0603WAF0000T5E: 电阻类型:厚膜电阻;阻值:0Ω;精度:±1%;功率:100mW;最大工作电压:75V;; LCSC Part Name: 0Ω ±1% 100mW 厚膜电阻; Supplier Part: C21189; Manufacturer: UNI-ROYAL(厚声); Supplier Footprint: 0603; JLCPCB Part Class: 基础库; Datasheet: https://atta.szlcsc.com/upload/public/pdf/source/20200306/C422600_1E6D84923E4A46A82E41ADD87F860B5C.pdf; Supplier: LCSC; Type: 厚膜电阻; Tolerance: ±1%; Power(Watts): 100mW; Overload Voltage (Max): 75V; Operating Temperature Range: -55℃~+155℃
U1 = SC130GS
U2 = XC6206P152MR: 输出类型:固定;工作电压:7V;输出电压:1.5V;输出电流:60mA;电源纹波抑制比(PSRR):-;输出极性:正极;; LCSC Part Name: 输入7V 输出1.5V 60mA; Supplier Part: C424701; Manufacturer: TOREX(特瑞仕); Supplier Footprint: SOT-23; JLCPCB Part Class: 扩展库; Datasheet: https://atta.szlcsc.com/upload/public/pdf/source/20200117/C484266_EE638359EA530088949E891FD0EEEA32.pdf; Supplier: LCSC; Output Type: 固定; Voltage - Supply: 7V; Output Voltage: 1.5V; Output Current: 60mA; Voltage Dropout: 860mV@(60mA); Features: 过流保护(OCP); Output Configuration: 正极; Number of Outputs: 1
U3 = XC6206P182MR_C21659: 输出类型:固定;工作电压:6V;输出电压:1.8V;输出电流:80mA;电源纹波抑制比(PSRR):-;输出极性:正极;; LCSC Part Name: 输入6V 输出1.8V 80mA; Supplier Part: C21659; Manufacturer: TOREX(特瑞仕); Supplier Footprint: SOT-23-3L; JLCPCB Part Class: 扩展库; Datasheet: https://atta.szlcsc.com/upload/public/pdf/source/20140319/1457707020604.pdf; Supplier: LCSC; Output Type: 固定; Voltage - Supply: 6V; Output Voltage: 1.8V; Output Current: 80mA; Voltage Dropout: 780mV@(60mA); Features: 短路保护(SCP)；低ESR；过流保护(OCP); Output Configuration: 正极; Number of Outputs: 1
X1 = OT503227MJBA4SL: 频率:27MHz;常温频差:±10ppm;输出模式:CMOS;工作电压:1.8V~3.3V;频率稳定度:±20ppm;; LCSC Part Name: YSO110TR 27MHZ 4P 5032 1.8V-3.3V ±10PPM -40~85℃（±20PPM) CMOS; Supplier Part: C717794; Manufacturer: YXC(扬兴晶振); Supplier Footprint: SMD5032-4P; JLCPCB Part Class: 扩展库; Datasheet: https://atta.szlcsc.com/upload/public/pdf/source/20240731/596E5F7673E50DA744B7F79F139FB8DF.pdf; Supplier: LCSC; Normal temperature Frequency Tolerance: ±10ppm; Output Type: CMOS; Voltage - Supply: 1.8V~3.3V; Frequency Stability: ±20ppm; Operating Temperature: -40℃~+85℃

## Nets
AGND: C1.2 C2.2 C3.2 C4.2 C5.2 C6.2 C7.2 C8.2 C9.1 C10.2 C11.2 C12.2 C13.2 C14.2 C15.2 C19.1 C20.2 C21.2 C22.2 C23.2 R10.1 U1.3(AGND) U1.39(AGND) U1.46(AGND) U1.49(AGND) U1.51(AGND) U1.58(AGND)
AVDD_3V3: C9.2 C10.1 C11.1 C12.1 C13.1 C14.1 C15.1 L1.2 U1.4(AVDD) U1.26(AVDD) U1.38(AVDD) U1.45(AVDD) U1.52(AVDD) U1.59(AVDD)
D1V8: C16.1 C17.1 C18.1 C35.2 C36.1 C37.1 R2.2 R3.2 R4.2 R5.2 R6.2 U1.7(DOVDD) U1.21(DOVDD) U3.2(Vout) X1.4(VDD)
D3V3: C31.2 C34.2 L1.1 L2.1 P1.1 P1.2 U2.3(VIN) U3.3(Vin)
DVDD_1V5: C24.2 C25.1 C26.1 C27.1 C28.1 C29.1 C30.1 C32.2 C33.1 U1.1(DVDD) U1.6(DVDD) U1.22(DVDD) U1.24(DVDD) U1.28(DVDD) U1.31(DVDD) U2.2(VOUT)
GND: C16.2 C17.2 C18.2 C24.1 C25.2 C26.2 C27.2 C28.2 C29.2 C30.2 C31.1 C32.1 C33.2 C34.1 C35.1 C36.2 C37.2 P1.5 P1.8 P1.11 P1.14 P1.17 P1.20 P1.25 P1.26 R7.2 R8.1 R9.1 R10.2 U1.2(DGND) U1.5(DGND) U1.14(DGND) U1.23(DGND) U1.30(DGND) U1.61(SPI_I2C_MODE) U2.1(VSS) U3.1(GND) X1.2(GND)
CMOS_PWDN: P1.3 R8.2 U1.60(PWDN)
CMOS_SCLK: P1.21 R4.1 U1.33(SDA)
CMOS_SDAT: P1.22 R5.1 U1.34(SCL)
CMOS_TRI0: P1.24 R2.1 U1.62(Trigger0)
CMOS_TRI1: P1.23 R3.1 U1.63(Trigger1)
CMOS_XCLK: R1.1 R11.1 U1.29(OSC)
MIPI_CLK_N: P1.13 U1.12(D5/CN)
MIPI_CLK_P: P1.12 U1.13(D4/CP)
MIPI_D0_N: P1.19 U1.8(D9/D0N)
MIPI_D0_P: P1.18 U1.9(D8/D0P)
MIPI_D1_N: P1.16 U1.10(D7/D1N)
MIPI_D1_P: P1.15 U1.11(D6/D1P)
MIPI_D2_N: P1.10 U1.17(D1/D2N)
MIPI_D2_P: P1.9 U1.18(D0/D2P)
MIPI_D3_N: P1.7 U1.19(FSYNC/D3N)
MIPI_D3_P: P1.6 U1.20(LREF/D3P)
PIXVDD_3V3: C19.2 C20.1 C21.1 C22.1 C23.1 L2.2 U1.44(PIXVDD) U1.48(PIXVDD) U1.50(PIXVDD) U1.53(PIXVDD)
SID: R6.1 R7.1 U1.64(SID)
SYNCN: U1.15(D3/SYNCN)
SYNCP: U1.16(D2/SYNCP)
$1N2008: P1.4 R1.2
$1N3094: R9.2 U1.25(VQPNS)
$1N3296: C1.1 C2.1 U1.40(VREFN2) U1.57(VREFN2)
$1N3599: C3.1 C4.1 U1.41(VREFN1) U1.56(VREFN1)
$1N3618: C5.1 C6.1 U1.42(VREFN) U1.55(VREFN)
$1N3637: C7.1 C8.1 U1.43(VREFH) U1.54(VREFH)
$1N5666: R11.2 X1.3(OUT)

Not connected (* = marked no-connect by the designer): J1 P$1 P$2; U1 27(PIXCLK)* 32(SS_B)* 35(SCK)* 36(MISO)* 37(MOSI)* 47(ATM)*; X1 1(TRI-STATE)*

## Notes on the sheet
- NC
- I2C地址 H:7'h32 L:7'h30

# Board PCB1
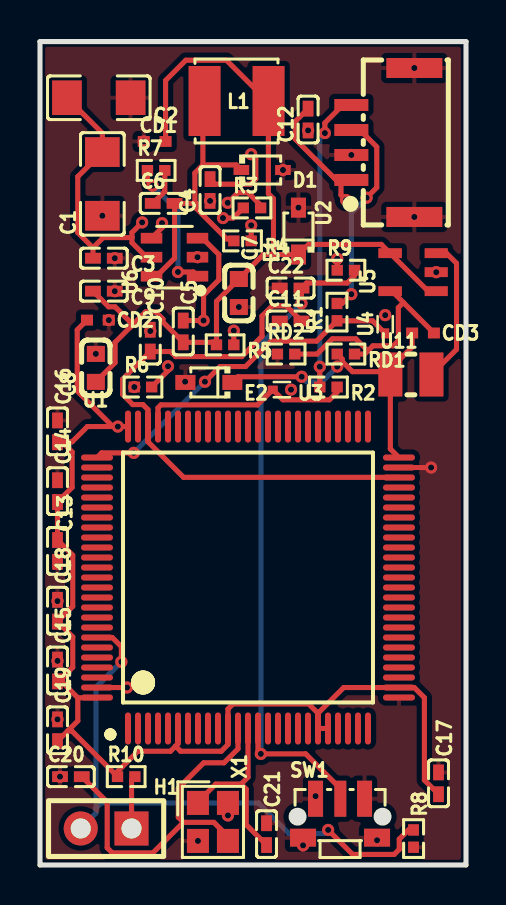
[diagram p2: board, top side]
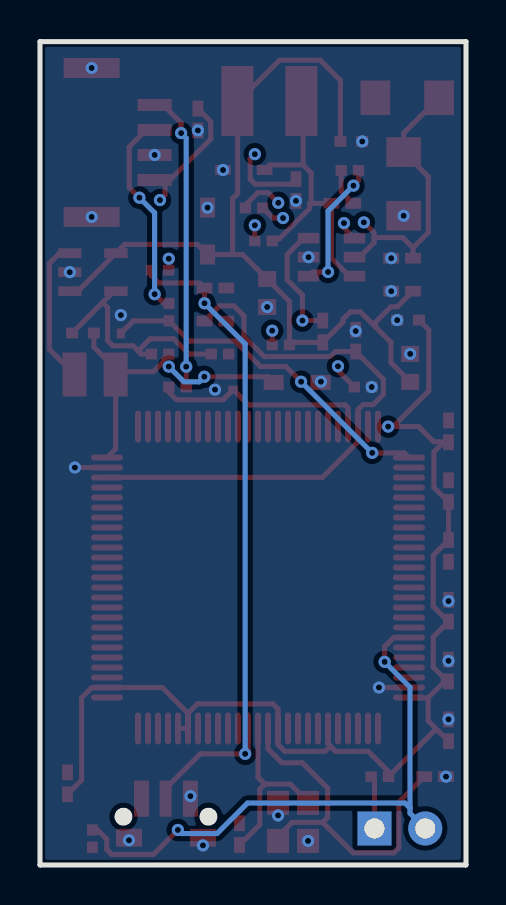
[diagram p3: board, bottom side, seen from below]

Outline 21.3 x 41.18 mm; copper layers: Top Layer, Inner1, Inner2, Bottom Layer. Coordinates in mm from the lower left corner of the outline.
Outline path: 0,41.18 21.3,41.18 21.3,0 0,0 0,41.18
Stack: Top Layer 0.035mm 外层铜厚1oz / Dielectric1 0.2104mm 7628 RC49% 8.6mil / Inner1 0.0152mm 内层铜厚 / Dielectric2 1.065mm 1.1mm H/HOZ Copper / Inner2 0.0152mm 内层铜厚 / Dielectric3 0.2104mm 7628 RC49% 8.6mil / Bottom Layer 0.035mm 外层铜厚1oz

## Design rules (mm)
template: JLCPCB Capability(Two Layers Board)
spacing copperThickness1oz (default): track to track 0.102, other pairs 0.152 to 0.3
spacing copperThickness2oz: track to track 0.203, other pairs 0.152 to 0.3
track width copperThickness1oz (default): min 0.127, default 0.254, max 2.54
track width copperThickness2oz: min 0.203, default 0.254, max 2.54
differential pair differentialPair (default): width min 0.127, default 0.254, max 2.54; gap min 0.152, default 0.152
via viaSize (default): diameter min 0.5, default 0.61, max 10; hole min 0.3, default 0.305, max 6.3

## Placement (name value [footprint] x y rotation side)
C1  10uF  [C1206]  3.12 34.06 90 top
C2  10uF  [C1206]  2.94 38.37 180 top
C3  100nF  [C0402#2]  3.19 30.35 180 top
C4  100nF  [C0402#2]  8.5 33.76 90 top
C5  33pF  [C0402#2]  7.16 26.68 270 top
C6  100nF  [C0402#2]  6.18 33.09 0 top
C7  22uF  [C0603]  9.94 28.61 270 top
C8  22uF  [C0603]  2.79 24.86 90 top
C9  100nF  [C0402#2]  3.19 28.7 180 top
C10  2.2uF  [C0402#2]  5.51 26.22 270 top
C11  2.2uF  [C0402#2]  12.53 27.2 0 top
C12  100nF  [C0402#2]  13.41 37.28 90 top
C13  100nF  [C0402#2]  0.88 15.71 90 top
C14  100nF  [C0402#2]  0.88 18.7 270 top
C15  100nF  [C0402#2]  0.88 9.73 270 top
C16  100nF  [C0402#2]  0.88 21.69 270 top
C17  100nF  [C0402#2]  19.93 4.09 270 top
C18  100nF  [C0402#2]  0.88 12.72 270 top
C19  100nF  [C0402#2]  0.88 6.74 270 top
C20  18pF  [C0402#2]  1.54 4.42 0 top
C21  18pF  [C0402#2]  11.33 1.54 270 top
C22  100nF  [C0402#2]  12.53 28.85 0 top
CD1  10uF  [C0402]  5.73 36.18 0 top
CD2  10uF  [C0402]  2.9 27.25 180 top
CD3  22pF  [C0402]  19.15 26.6 180 top
D1  SD103AWS  [SOD-323_L1.7-W1.3-LS2.5-FD]  11.11 34.76 180 top
E1  CESD5V0D3 ZA  [SOD-323_L1.8-W1.3-LS2.5-RD]  12.92 31.7 90 top
E2  CESD3V3D3 YU  [SOD-323_L1.8-W1.3-LS2.5-RD]  8.44 24.13 180 top
H1  -  [HDR-TH_2P-P2.54-V-F]  3.31 1.83 180 top
L1  10uH  [IND-SMD_L4.0-W4.0]  9.83 38.21 0 top
R1  22Ω  [R0402]  14.85 27.65 90 top
R2  22Ω  [R0402]  14.43 23.9 180 top
R3  100kΩ  [R0402]  10.6 32.86 0 top
R4  10Ω  [R0402]  10.13 31.21 180 top
R5  40.2kΩ  [R0402]  9.26 26.01 180 top
R6  7.68kΩ  [R0402]  5.15 23.9 0 top
R7  10Ω  [R0402]  5.81 34.74 0 top
R8  10kΩ  [R0402]  18.68 1.32 270 top
R9  10kΩ  [R0402]  15.3 29.74 0 top
R10  22Ω  [R0402]  4.31 4.42 0 top
RD1  680K  [R0402]  15.3 25.55 180 top
RD2  150K  [R0402]  12.31 25.55 0 top
SW1  SKRTLAE010  [KEY-SMD_SKRTLAE010]  15 2.34 0 top
U1  STM32H723VGT6  [LQFP-100_L14.0-W14.0-P0.50-LS16.0-BL]  10.4 14.38 0 top
U2  WAFER-GH1.25-4PWB  [CONN-SMD_4P-P1.25_XUNPU_WAFER-GH1.25-4PWB]  17.15 36.13 90 top
U3  ESD9B5.0ST5G  [SOD-923_L0.8-W0.6-LS1.0-BI]  12.1 23.77 180 top
U4  ESD9B5.0ST5G  [SOD-923_L0.8-W0.6-LS1.0-BI]  17.26 27.04 90 top
U5  XT3410AFMR-G  [SOT-23-5_L3.0-W1.7-P0.95-LS2.8-BL]  18.66 29.65 90 top
U6  BL9342  [SOT-23-6_L2.9-W1.6-P0.95-LS2.8-BL]  6.73 30.4 90 top
U11  2.2uH  [IND-SMD_L2.5-W2.0]  18.55 24.53 0 top
X1  24MHz  [CRYSTAL-SMD_4P-L2.5-W2.0-BL]  8.65 2.15 270 top

## Footprints (pads in the part's own frame, mm; a bottom-side part is the same pattern mirrored in y, then rotated)
C0402
  rect 0.6x0.54 smd: 1(-0.545,0) 2(0.545,0)
C0402#2
  rect 0.79x0.54 smd: 1(-0.545,0) 2(0.545,0)
C0603
  rect 0.8x0.9 smd: 1(-0.7,0) 2(0.7,0)
C1206
  rect 1.485x1.728 smd: 1(-1.593,0) 2(1.593,0)
CONN-SMD_4P-P1.25_XUNPU_WAFER-GH1.25-4PWB
  rect 0.6x1.7 smd: 1(-1.875,1.575) 2(-0.625,1.575) 3(0.625,1.575) 4(1.875,1.575)
  rect 1x2.8 smd: 5(3.725,-1.575) 6(-3.725,-1.575)
CRYSTAL-SMD_4P-L2.5-W2.0-BL
  rect 1.2x1.1 smd: 1(-0.95,-0.75) 2(0.95,-0.75) 3(0.95,0.75) 4(-0.95,0.75)
HDR-TH_2P-P2.54-V-F
  rect 1.7x1.7 hole 1: 1(-1.27,0)
  round 1.7 hole 1: 2(1.27,0)
IND-SMD_L2.5-W2.0
  rect 1.2x2.2 smd: 1(1.028,0) 2(-1.028,0)
IND-SMD_L4.0-W4.0
  rect 1.6x3.5 smd: 1(-1.6,0) 2(1.6,0)
KEY-SMD_SKRTLAE010
  rect 0.75x1.8 smd: 1(-1.225,0.975) 3(1.225,0.975)
  rect 0.6x1.8 smd: 2(0.015,0.975)
  rect 1.3x0.9 smd: 4(-1.85,-0.975) 5(1.85,-0.975)
LQFP-100_L14.0-W14.0-P0.50-LS16.0-BL
  oval 0.3x1.6 smd: 1(-6,-7.55) 2(-5.5,-7.55) 3(-5,-7.55) 4(-4.5,-7.55) 5(-4,-7.55) 6(-3.5,-7.55) 7(-3,-7.55) 8(-2.5,-7.55) 9(-2,-7.55) 10(-1.5,-7.55) 11(-1,-7.55) 12(-0.5,-7.55) 13(0,-7.55) 14(0.5,-7.55) 15(1,-7.55) 16(1.5,-7.55) 17(2,-7.55) 18(2.5,-7.55) 19(3,-7.55) 20(3.5,-7.55) 21(4,-7.55) 22(4.5,-7.55) 23(5,-7.55) 24(5.5,-7.55) 25(6,-7.55) 51(6,7.55) 52(5.5,7.55) 53(5,7.55) 54(4.5,7.55) 55(4,7.55) 56(3.5,7.55) 57(3,7.55) 58(2.5,7.55) 59(2,7.55) 60(1.5,7.55) 61(1,7.55) 62(0.5,7.55) 63(0,7.55) 64(-0.5,7.55) 65(-1,7.55) 66(-1.5,7.55) 67(-2,7.55) 68(-2.5,7.55) 69(-3,7.55) 70(-3.5,7.55) 71(-4,7.55) 72(-4.5,7.55) 73(-5,7.55) 74(-5.5,7.55) 75(-6,7.55)
  oval 1.6x0.3 smd: 26(7.55,-6) 27(7.55,-5.5) 28(7.55,-5) 29(7.55,-4.5) 30(7.55,-4) 31(7.55,-3.5) 32(7.55,-3) 33(7.55,-2.5) 34(7.55,-2) 35(7.55,-1.5) 36(7.55,-1) 37(7.55,-0.5) 38(7.55,0) 39(7.55,0.5) 40(7.55,1) 41(7.55,1.5) 42(7.55,2) 43(7.55,2.5) 44(7.55,3) 45(7.55,3.5) 46(7.55,4) 47(7.55,4.5) 48(7.55,5) 49(7.55,5.5) 50(7.55,6) 76(-7.55,6) 77(-7.55,5.5) 78(-7.55,5) 79(-7.55,4.5) 80(-7.55,4) 81(-7.55,3.5) 82(-7.55,3) 83(-7.55,2.5) 84(-7.55,2) 85(-7.55,1.5) 86(-7.55,1) 87(-7.55,0.5) 88(-7.55,0) 89(-7.55,-0.5) 90(-7.55,-1) 91(-7.55,-1.5) 92(-7.55,-2) 93(-7.55,-2.5) 94(-7.55,-3) 95(-7.55,-3.5) 96(-7.55,-4) 97(-7.55,-4.5) 98(-7.55,-5) 99(-7.55,-5.5) 100(-7.55,-6)
R0402
  rect 0.566x0.54 smd: 1(-0.433,0) 2(0.433,0)
SOD-323_L1.7-W1.3-LS2.5-FD
  rect 0.78x0.5 smd: 1(-1.04,0) 2(1.04,0)
SOD-323_L1.8-W1.3-LS2.5-RD
  rect 1x0.75 smd: 1(-1.173,0) 2(1.173,0)
SOD-923_L0.8-W0.6-LS1.0-BI
  rect 0.5x0.4 smd: 1(-0.457,0) 2(0.457,0)
SOT-23-5_L3.0-W1.7-P0.95-LS2.8-BL
  rect 0.49x1.157 smd: 1(-0.95,-1.153) 2(0,-1.153) 3(0.95,-1.153)
  rect 0.49x1.175 smd: 4(0.95,1.153) 5(-0.95,1.153)
SOT-23-6_L2.9-W1.6-P0.95-LS2.8-BL
  rect 0.532x1.072 smd: 1(-0.95,-1.149) 2(0,-1.149) 3(0.95,-1.149) 4(0.95,1.149) 5(0,1.149) 6(-0.95,1.149)

## Nets
As in the schematic.

Pads without a net: U1 1 2 3 4 5 7 8 9 15 16 17 18 22 23 24 25 28 29 30 31 32 33 34 35 36 37 38 39 40 41 42 43 44 45 46 47 51 52 53 54 55 56 57 58 59 60 61 62 63 64 65 66 67 68 69 70 71 77 78 79 80 81 82 83 84 85 86 87 88 89 90 91 92 93 95 96 97 98

## Via types
v1: diameter 0.61, hole 0.305, Top Layer to Bottom Layer, 58 vias

## Routing (per net, layer and track width the routed paths; a pad name or vN(x,y) marks a point on that pad's centre or on a via; arc(x,y) is an arc through that point)
GND: length 3.1
  Top Layer w0.254: 2.85,8.88 v1(4.35,8.88) ; v1(19.56,19.88) U1.49
  vias: v1(0.88,13.2) v1(0.88,10.21) v1(0.88,7.28) v1(1,4.42) v1(2.79,25.56) v1(3.12,32.47) v1(3.44,27.25) v1(3.74,30.35) v1(3.74,28.7) v1(4.72,23.9) v1(5.19,36.18) v1(5.51,26.7) v1(7.26,24.17) v1(7.88,30.4) v1(7.9,1.2) v1(8.5,33.21) v1(9.4,2.48) v1(9.94,27.91) v1(12.15,34.76) v1(12.55,23.77) v1(12.92,32.87) v1(13.15,0.98) v1(13.41,36.74) v1(13.78,3.44) v1(15.57,35.51) v1(16.85,1.24) v1(17.26,27.5) v1(18.72,39.86) v1(18.72,32.41) v1(19.81,29.65)
VCC_3V3: length 101.5
  Top Layer w0.254: v1(14.86,30.32) R9.1 ; C12.2 12.76,37.18 12.76,36.3 14.8,34.27 15.05,34.27 ; 1.89,8.36 1.13,9.12 1.13,9.38 ; 1.89,8.36 2.84,8.36 U1.100 ; 1.89,8.36 1.89,7.21 1.38,6.7 ; 1.1,21.16 1.61,21.16 2.37,21.93 3.64,21.93 ; 1.1,21.16 0.9,21.16 C16.2 ; 1.1,21.16 1.61,20.66 1.61,18.89 C14.2 C13.2 1.64,15.49 1.64,12.93 0.88,12.17 1.64,11.41 1.64,9.89 1.13,9.38 ; 1.13,9.38 C15.2 ; 17.38,24.67 18.61,25.9 CD3.2 ; 17.38,24.67 15.63,24.67 15.12,25.18 ; 17.38,24.67 U11.2 17.52,20.81 U1.50 ; 15.05,34.27 15.56,34.27 U2.1 ; 15.05,34.27 15.05,33.51 v1(15.3,33.25) ; U1.75 v1(3.89,21.93) 3.64,21.93 ; 6.78,5.94 7.03,5.69 9.06,5.69 9.4,6.03 U1.11 9.4,7.8 9.66,8.06 13.43,8.06 13.9,7.59 ; 6.78,5.94 6.9,6.06 U1.6 ; 6.78,5.94 6.53,5.69 4.89,5.69 3.88,4.67 3.88,4.42 1.59,6.7 1.38,6.7 ; CD2.2 1.86,26.76 1.86,23.7 3.64,21.93 ; 13.9,7.59 U1.20 U1.21 ; 13.9,7.59 15.19,8.88 18.71,8.88 19.22,8.37 19.22,4.25 C17.2 ; 1.38,6.7 C19.2 ; v1(14.86,24.93) 15.12,25.18 ; 15.12,25.18 15.12,25.3 RD1.2 ; 9.62,24.13 9.9,24.42 v1(13.09,24.42)
  Inner1 w0.254: 14.8,30.32 14.8,25.25 14.86,25.18 v1(14.86,24.93) ; 14.8,30.32 v1(14.86,30.32) ; 14.8,30.32 14.36,30.32 14.29,30.39 14.29,32.24 v1(15.3,33.25) ; v1(3.89,21.93) 9.8,21.93 12.29,24.42 v1(13.09,24.42)
  Bottom Layer w0.254: v1(14.86,24.93) 14.1,24.16 13.34,24.16 v1(13.09,24.42)
VCC_5VS: length 44.5
  Top Layer w0.254: 4.52,26.9 4.52,27.15 3.75,27.92 3.43,27.92 C9.2 ; 4.52,26.9 3.75,26.14 3.75,25.12 C8.1 ; 4.52,26.9 5.28,27.66 5.79,27.66 6.15,27.3 6.15,27.15 C5.2 8.7,26.14 R5.2 8.83,28.19 C7.1 11.17,30.53 11.68,30.53 ; 11.1,38.22 11.1,38.47 9.32,40.25 7.29,40.25 6.28,39.24 CD1.2 ; 11.1,38.22 11.1,37.45 11.42,37.13 11.42,33.58 11.68,33.32 11.68,30.53 ; 11.1,38.22 11.42,38.22 L1.2 ; 11.68,30.53 E1.1 13.43,31.04 17.07,31.04 U5.4 19.41,28.7 U5.1
VCC_IN: length 22.1
  Top Layer w0.254: 2.65,30.87 3.16,31.38 4.6,31.38 ; 2.65,30.87 1.89,31.63 1.89,34.42 C1.2 3.12,36.6 C2.2 ; 2.65,30.87 C3.2 ; 4.6,31.38 4.6,31.63 v1(5.11,32.14) ; 4.6,31.38 4.6,31.12 5.32,30.4 U6.5 ; v1(9.39,33.12) 9.9,33.62 10.4,33.62 11.03,33 R3.2
  Inner1 w0.254: v1(9.39,33.12) 9.09,33.42 9.09,33.45 8.75,33.8 6.28,33.8 5.11,32.63 v1(5.11,32.14)
BOOT1: length 29.3
  Top Layer w0.254: R8.1 18.43,1.75 17.97,1.29 17.97,0.78 17.71,0.53 15.63,0.53 v1(14.41,1.75) ; v1(4.07,10.16) 4.07,10.92 3.61,11.38 U1.94
  Bottom Layer w0.254: v1(4.07,10.16) 2.8,8.89 2.8,2.84 ; H1.2 2.8,2.59 2.8,2.84 ; v1(14.41,1.75) 14.23,1.57 12.45,1.57 10.93,3.1 3.05,3.1 2.8,2.84
NRST: length 33.8
  Top Layer w0.254: SW1.2 15.02,3.82 13.29,5.56 v1(11.04,5.56) 10.9,5.7 U1.14 ; 15.73,29.74 15.73,29.47 15.36,29.11 13.33,29.11 C22.2 v1(13.08,28.09)
  Bottom Layer w0.254: v1(11.04,5.56) 11.04,26.06 v1(13.08,28.09)
PH0-OSC_IN: length 18
  Top Layer w0.254: 7.17,2.13 6.92,2.39 6.92,3.84 8.19,5.11 9.2,5.11 9.9,5.81 U1.12 ; 7.17,2.13 5.65,0.61 3.61,0.61 3.36,0.86 3.36,3.15 C20.2 ; 7.17,2.13 8.69,2.13 9.4,1.43 X1.3
PH0-OSC_OUT: length 9.1
  Top Layer w0.254: C21.2 10.31,2.02 10.31,3.79 10.06,4.05 ; X1.1 7.9,3.16 8.79,4.05 10.06,4.05 ; 10.06,4.05 10.4,4.39 U1.13
SWCLK: length 17.5
  Top Layer w0.254: v1(4.69,20.61) 3.09,20.61 U1.76 ; 17.26,26.58 16.63,27.22 R1.1 13.84,26.2 11.55,26.2 10.28,24.93 9.01,24.93 v1(8.25,24.17)
  Bottom Layer w0.254: v1(8.25,24.17) v1(4.69,20.61)
SWDIO: length 10.9
  Top Layer w0.254: U1.72 5.9,22.86 6.05,23.01 10.88,23.01 U3.2 12.15,23.27 14.47,23.27 14.86,23.65 R2.1
VCAP: length 28.8
  Top Layer w0.254: U1.48 17.94,19.39 7.18,19.39 5.4,21.16 U1.73 5.4,22.77 5.15,23.03 4.64,23.03 4.13,23.53 4.13,24.3 C10.2 6.53,25.68 6.78,25.42 10.09,25.42 11.1,26.44 11.1,27.46 11.61,27.96 12.31,27.96 C11.2
$1N3775: length 10.4
  Top Layer w0.254: v1(15.57,28.55) 15.1,28.08 R1.2 ; v1(16.33,33.37) 16.84,33.88 16.84,35.91 15.99,36.76 U2.3
  Bottom Layer w0.254: v1(16.33,33.37) 15.57,32.61 v1(15.57,28.55)
$1N3814: length 15
  Top Layer w0.254: U2.4 15.44,37.87 15.01,37.87 14.25,37.11 v1(14.25,36.6) ; R2.2 v1(13.99,24.92)
  Bottom Layer w0.254: v1(13.99,24.92) 13.99,36.35 v1(14.25,36.6)
$1N4985: length 7.3
  Top Layer w0.254: U5.3 20.32,30.6 20.83,30.09 20.83,25.79 U11.1
$1N4987: length 11.8
  Top Layer w0.254: CD3.1 18.17,28.13 ; 18.17,28.13 17.92,27.87 17.92,26.22 17.67,25.97 16.65,25.97 16.4,25.71 ; 18.17,28.13 17.6,28.7 U5.5 ; 16.4,25.71 15.79,26.31 14.62,26.31 13.86,25.55 RD2.2 ; 16.4,25.71 16.24,25.55 15.73,25.55
$1N6159: length 5.4
  Top Layer w0.254: v1(6.1,32.1) 6.1,31.87 U6.4 ; R3.1 9.66,32.35 v1(9.15,32.35)
  Inner2 w0.254: v1(9.15,32.35) 6.36,32.35 v1(6.1,32.1)
$1N6463: length 8.2
  Top Layer w0.254: v1(10.56,31.99) R4.1 ; v1(10.56,35.55) 10.79,35.32 10.79,34.3 10.54,34.05 8.76,34.05 C4.2
  Inner2 w0.254: v1(10.56,35.55) v1(10.56,31.99)
$1N6883: length 6.8
  Top Layer w0.254: U6.1 7.67,29.66 v1(6.9,29.66) ; 5.38,34.74 5.38,34.23 v1(5.63,33.97)
  Bottom Layer w0.254: v1(6.9,29.66) 6.9,32.7 v1(5.63,33.97)
$1N6991: length 1.9
  Top Layer w0.254: R7.2 6.24,33.69 C6.1
$1N7111: length 12.7
  Top Layer w0.254: C5.1 v1(8.18,27.23) 8.18,28.5 8.94,29.26 8.94,30.53 8.18,31.29 7.93,31.29 U6.3 ; R6.2 6.4,24.72 v1(6.4,24.94) ; v1(9.69,26.72) R5.1
  Inner2 w0.254: v1(8.18,27.23) 8.43,26.97 ; 8.43,26.97 v1(6.4,24.94) ; 8.43,26.97 8.69,26.72 v1(9.69,26.72)
$1N7412: length 15.5
  Top Layer w0.254: 7.75,33.09 7.75,34.61 8.14,35.01 ; 7.75,33.09 C6.2 6.73,30.34 5.97,29.58 5.71,29.58 U6.6 ; 7.75,33.09 7.82,33.09 7.82,32.83 9.34,31.31 9.6,31.31 R4.2 ; 10.07,34.76 9.82,35.01 8.14,35.01 ; 8.14,35.01 8.14,38.12 L1.1
$1N16429: length 2.7
  Top Layer w0.254: R10.2 4.58,4.25 H1.1

## Copper pours and planes (outline as drawn; the poured copper is in the pictures)
GND on Top Layer: 0,41.18 21.3,41.18 21.3,0 0,0
GND on Bottom Layer: 0,41.18 21.3,41.18 21.3,0 0,0

# Board PCB2
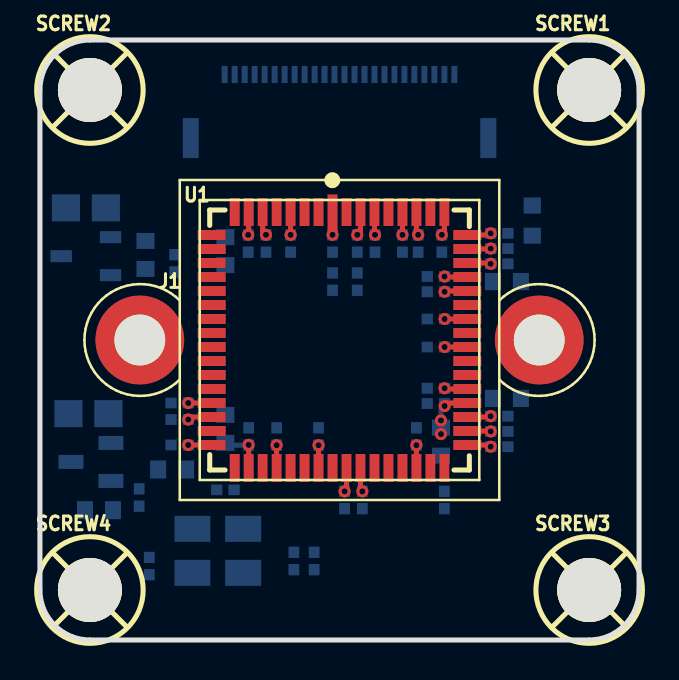
[diagram p4: board, top side]
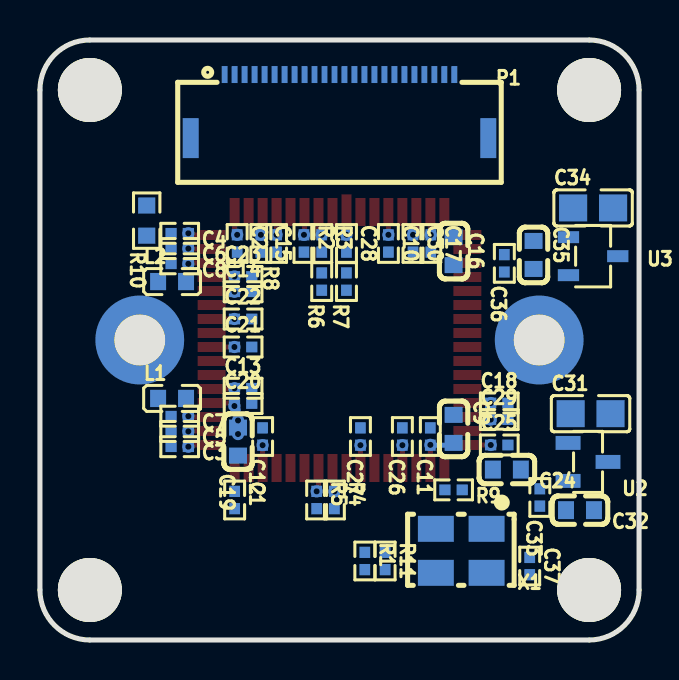
[diagram p5: board, bottom side, seen from below]

Outline 30 x 30 mm; copper layers: Top Layer, Inner1, Inner2, Bottom Layer. Coordinates in mm from the lower left corner of the outline.
Outline path: 0,27.5 0,2.5 arc(0.73,0.73) 2.5,0 27.5,0 arc(29.27,0.73) 30,2.5 30,27.5 arc(29.27,29.27) 27.5,30 2.5,30 arc(0.73,29.27) 0,27.5
Stack: Top Layer 0.035mm 外层铜厚1oz / Dielectric1 0.2104mm 7628 RC49% 8.6mil / Inner1 0.0152mm 内层铜厚 / Dielectric2 1.065mm 1.1mm H/HOZ Copper / Inner2 0.0152mm 内层铜厚 / Dielectric3 0.2104mm 7628 RC49% 8.6mil / Bottom Layer 0.035mm 外层铜厚1oz

## Design rules (mm)
net MIPI_D0_P: MIPI_D0
net MIPI_D0_N: MIPI_D0
template: JLCPCB Capability(Two Layers Board)
spacing copperThickness1oz (default): track to track 0.102, other pairs 0.152 to 0.3
spacing copperThickness2oz: track to track 0.203, other pairs 0.152 to 0.3
track width copperThickness1oz (default): min 0.127, default 0.254, max 2.54
track width copperThickness2oz: min 0.203, default 0.254, max 2.54
differential pair differentialPair (default): width min 0.127, default 0.254, max 2.54; gap min 0.152, default 0.152
via viaSize (default): diameter min 0.5, default 0.61, max 10; hole min 0.3, default 0.305, max 6.3

## Placement (name value [footprint] x y rotation side)
C1  100nF  [R0402]  20.25 7 270 bottom
C2  100nF  [R0402]  20.12 19.83 270 bottom
C3  100nF  [R0402]  23 9.67 0 bottom
C4  100nF  [R0402]  23 20.33 0 bottom
C5  100nF  [R0402]  23 10.43 0 bottom
C6  100nF  [R0402]  23 19.57 0 bottom
C7  100nF  [R0402]  23 11.19 0 bottom
C8  100nF  [R0402]  23 18.81 0 bottom
C9  10uF  [C0603]  9.29 10.56 270 bottom
C10  100nF  [R0402]  12.55 19.83 270 bottom
C11  100nF  [R0402]  10.45 10.17 90 bottom
C12  100nF  [R0402]  18.85 10.17 90 bottom
C13  100nF  [R0402]  19.83 12.59 180 bottom
C14  100nF  [R0402]  19.83 17.41 180 bottom
C15  100nF  [R0402]  18.94 19.83 270 bottom
C16  10uF  [C0603]  9.29 19.44 270 bottom
C17  100nF  [R0402]  10.43 19.83 270 bottom
C18  100nF  [R0402]  7 11.85 180 bottom
C19  10uF  [C0603]  20.08 9.92 90 bottom
C20  100nF  [R0402]  19.83 11.83 180 bottom
C21  100nF  [R0402]  19.83 14.65 180 bottom
C22  100nF  [R0402]  19.83 16.05 180 bottom
C23  100nF  [R0402]  19.83 18.17 180 bottom
C24  10uF  [C0603]  6.62 8.52 0 bottom
C25  100nF  [R0402]  7 9.75 180 bottom
C26  100nF  [R0402]  11.85 10.17 90 bottom
C27  100nF  [R0402]  13.95 10.17 90 bottom
C28  100nF  [R0402]  14.65 19.83 270 bottom
C29  100nF  [R0402]  7 11.02 180 bottom
C30  100nF  [R0402]  11.32 19.83 270 bottom
C31  22uF  [C0805]  2.43 11.32 180 bottom
C32  10uF  [C0603]  2.96 6.49 0 bottom
C33  100nF  [R0402]  4.97 7.13 90 bottom
C34  22uF  [C0805]  2.3 21.6 180 bottom
C35  10uF  [C0603]  5.28 19.25 270 bottom
C36  100nF  [R0402]  6.75 18.83 90 bottom
C37  100nF  [R0402]  5.48 3.7 270 bottom
J1  -  [LENSMOUNT-20MM]  15 15 0 top
L1  BLM18PG471SN1D  [L0603]  23.38 12.08 180 bottom
L2  BLM18PG471SN1D  [L0603]  23.38 17.92 180 bottom
P1  FH52-24S-0.5SH  [CONN-SMD_FH52-24S-0.5SH05]  15 26.68 180 bottom
R1  33Ω  [R0402]  13.73 3.95 270 bottom
R2  1kΩ  [R0402]  16.78 19.83 270 bottom
R3  1kΩ  [R0402]  15.89 19.83 270 bottom
R4  4.7kΩ  [R0402]  15.25 7 270 bottom
R5  4.7kΩ  [R0402]  16.14 7 270 bottom
R6  4.7kΩ  [R0402]  15.89 17.92 90 bottom
R7  4.7kΩ  [R0402]  14.65 17.92 90 bottom
R8  4.7kΩ  [R0402]  18.15 19.83 90 bottom
R9  4.7kΩ  [R0402]  9.29 7.51 0 bottom
R10  0Ω  [R0603]  24.65 20.97 90 bottom
R11  33Ω  [R0402]  12.72 3.95 270 bottom
SCREW1  -  [M3螺丝]  27.5 27.5 0 top
SCREW2  -  [M3螺丝]  2.5 27.5 0 top
SCREW3  -  [M3螺丝]  27.5 2.5 0 top
SCREW4  -  [M3螺丝]  2.5 2.5 0 top
U1  -  [CLCC-64_L13.0-W13.0-P0.70-T]  15 15 0 top
U2  XC6206P152MR  [SOT-23-3_L2.9-W1.3-P1.90-LS2.4-BR]  2.56 8.9 0 bottom
U3  XC6206P182MR  [SOT-23-3_L2.9-W1.6-P1.90-LS2.8-BR]  2.3 19.19 0 bottom
X1  27MHz  [OSC-SMD_4P-L5.0-W3.2-BL-1]  8.91 4.46 0 bottom

## Footprints (pads in the part's own frame, mm; a bottom-side part is the same pattern mirrored in y, then rotated)
C0603
  rect 0.8x0.9 smd: 1(-0.7,0) 2(0.7,0)
C0805
  rect 1.41x1.35 smd: 1(-1,0) 2(1,0)
CLCC-64_L13.0-W13.0-P0.70-T
  rect 0.5x2 smd: 1(-0.35,6.28)
  rect 0.5x1.4 smd: 2(-1.05,6.4) 3(-1.75,6.4) 4(-2.45,6.4) 5(-3.15,6.4) 6(-3.85,6.4) 7(-4.55,6.4) 8(-5.25,6.4) 25(-5.25,-6.4) 26(-4.55,-6.4) 27(-3.85,-6.4) 28(-3.15,-6.4) 29(-2.45,-6.4) 30(-1.75,-6.4) 31(-1.05,-6.4) 32(-0.35,-6.4) 33(0.35,-6.4) 34(1.05,-6.4) 35(1.75,-6.4) 36(2.45,-6.4) 37(3.15,-6.4) 38(3.85,-6.4) 39(4.55,-6.4) 40(5.25,-6.4) 57(5.25,6.4) 58(4.55,6.4) 59(3.85,6.4) 60(3.15,6.4) 61(2.45,6.4) 62(1.75,6.4) 63(1.05,6.4) 64(0.35,6.4)
  rect 1.4x0.5 smd: 9(-6.4,5.25) 10(-6.4,4.55) 11(-6.4,3.85) 12(-6.4,3.15) 13(-6.4,2.45) 14(-6.4,1.75) 15(-6.4,1.05) 16(-6.4,0.35) 17(-6.4,-0.35) 18(-6.4,-1.05) 19(-6.4,-1.75) 20(-6.4,-2.45) 21(-6.4,-3.15) 22(-6.4,-3.85) 23(-6.4,-4.55) 24(-6.4,-5.25) 41(6.4,-5.25) 42(6.4,-4.55) 43(6.4,-3.85) 44(6.4,-3.15) 45(6.4,-2.45) 46(6.4,-1.75) 47(6.4,-1.05) 48(6.4,-0.35) 49(6.4,0.35) 50(6.4,1.05) 51(6.4,1.75) 52(6.4,2.45) 53(6.4,3.15) 54(6.4,3.85) 55(6.4,4.55) 56(6.4,5.25)
CONN-SMD_FH52-24S-0.5SH05
  rect 0.3x0.85 smd: 1(-5.75,1.589) 2(-5.25,1.589) 3(-4.75,1.589) 4(-4.25,1.589) 5(-3.75,1.589) 6(-3.25,1.589) 7(-2.75,1.589) 8(-2.25,1.589) 9(-1.75,1.589) 10(-1.25,1.589) 11(-0.75,1.589) 12(-0.25,1.589) 13(0.25,1.589) 14(0.75,1.589) 15(1.25,1.589) 16(1.75,1.589) 17(2.25,1.589) 18(2.75,1.589) 19(3.25,1.589) 20(3.75,1.589) 21(4.25,1.589) 22(4.75,1.589) 23(5.25,1.589) 24(5.75,1.589)
  rect 0.8x2 smd: 25(-7.45,-1.589) 26(7.45,-1.589)
L0603
  rect 0.8x0.864 smd: 1(-0.7,0) 2(0.7,0)
LENSMOUNT-20MM
  round 4.445 hole 2.54: P$1(-10,0) P$2(10,0)
M3螺丝
  round 3.2 hole 3.2: 1(0,0)
OSC-SMD_4P-L5.0-W3.2-BL-1
  rect 1.8x1.3 smd: 1(-1.27,-1.1) 2(1.27,-1.1) 3(1.27,1.1) 4(-1.27,1.1)
R0402
  rect 0.566x0.54 smd: 1(-0.433,0) 2(0.433,0)
R0603
  rect 0.806x0.864 smd: 1(-0.753,0) 2(0.753,0)
SOT-23-3_L2.9-W1.3-P1.90-LS2.4-BR
  rect 1.25x0.7 smd: 1(1,-0.95) 2(1,0.95) 3(-1,0)
SOT-23-3_L2.9-W1.6-P1.90-LS2.8-BR
  rect 1.07x0.6 smd: 1(1.235,-0.95) 2(1.235,0.95) 3(-1.235,0)

## Nets
As in the schematic.

Pads without a net: J1 P$1 P$2; SCREW1 1; SCREW2 1; SCREW3 1; SCREW4 1; U1 27 32 35 36 37 47; X1 1

## Via types
v1: diameter 0.61, hole 0.305, Top Layer to Bottom Layer, 32 vias

## Routing (per net, layer and track width the routed paths; a pad name or vN(x,y) marks a point on that pad's centre or on a via; arc(x,y) is an arc through that point)
AVDD_3V3: length 8.1
  Top Layer w0.254: U1.45 20.3,12.55 v1(20.26,12.59) ; v1(18.94,20.26) 18.85,20.35 U1.59 ; v1(12.55,20.26) U1.4 ; v1(20.26,17.41) 20.3,17.45 U1.52 ; v1(10.45,9.76) U1.26 ; v1(18.85,9.74) U1.38
  Bottom Layer w0.254: C9.2 9.4,9.74 C11.1
D1V8: length 2.3
  Top Layer w0.254: v1(10.43,20.26) 10.45,20.28 U1.7 ; v1(7.43,11.85) U1.21
DVDD_1V5: length 6.9
  Top Layer w0.254: v1(14.65,20.26) U1.1 ; v1(11.85,9.74) U1.28 ; U1.22 7.55,11.15 v1(7.43,11.02) ; U1.6 11.15,20.43 v1(11.32,20.26) ; v1(13.95,9.74) U1.31 ; v1(7.43,9.75) U1.24
CMOS_PWDN: length 1.1
  Top Layer w0.254: v1(18.15,20.26) U1.60
CMOS_SCLK: length 1.2
  Top Layer w0.254: U1.33 15.35,7.53 v1(15.25,7.43)
CMOS_SDAT: length 1.2
  Top Layer w0.254: v1(16.14,7.43) 16.05,7.53 U1.34
CMOS_TRI0: length 1.2
  Top Layer w0.254: v1(16.78,20.26) 16.75,20.29 U1.62
CMOS_TRI1: length 1.2
  Top Layer w0.254: v1(15.89,20.26) 16.05,20.42 U1.63
PIXVDD_3V3: length 5.9
  Top Layer w0.254: v1(20.26,18.17) 20.29,18.15 U1.53 ; U1.44 20.41,11.85 v1(20.26,11.7) ; v1(20.26,14.65) U1.48 ; v1(20.26,16.05) U1.50
  Bottom Layer w0.254: 20.08,10.49 v1(20.08,10.98) 20.08,11.52 v1(20.26,11.7)
  vias: v1(20.08,10.3)
$1N3296: length 1.2
  Top Layer w0.254: v1(20.12,20.26) 20.25,20.39 U1.57
$1N3599: length 2.4
  Top Layer w0.254: U1.41 22.49,9.75 v1(22.57,9.67) ; v1(22.57,20.33) 22.49,20.25 U1.56
$1N3618: length 2.4
  Top Layer w0.254: v1(22.57,10.43) 22.55,10.45 U1.42 ; v1(22.57,19.57) 22.55,19.55 U1.55
$1N3637: length 2.4
  Top Layer w0.254: v1(22.57,11.19) 22.53,11.15 U1.43 ; U1.54 22.53,18.85 v1(22.57,18.81)
